# Altium project sombreakout.PrjPcb (part 1 of 2)
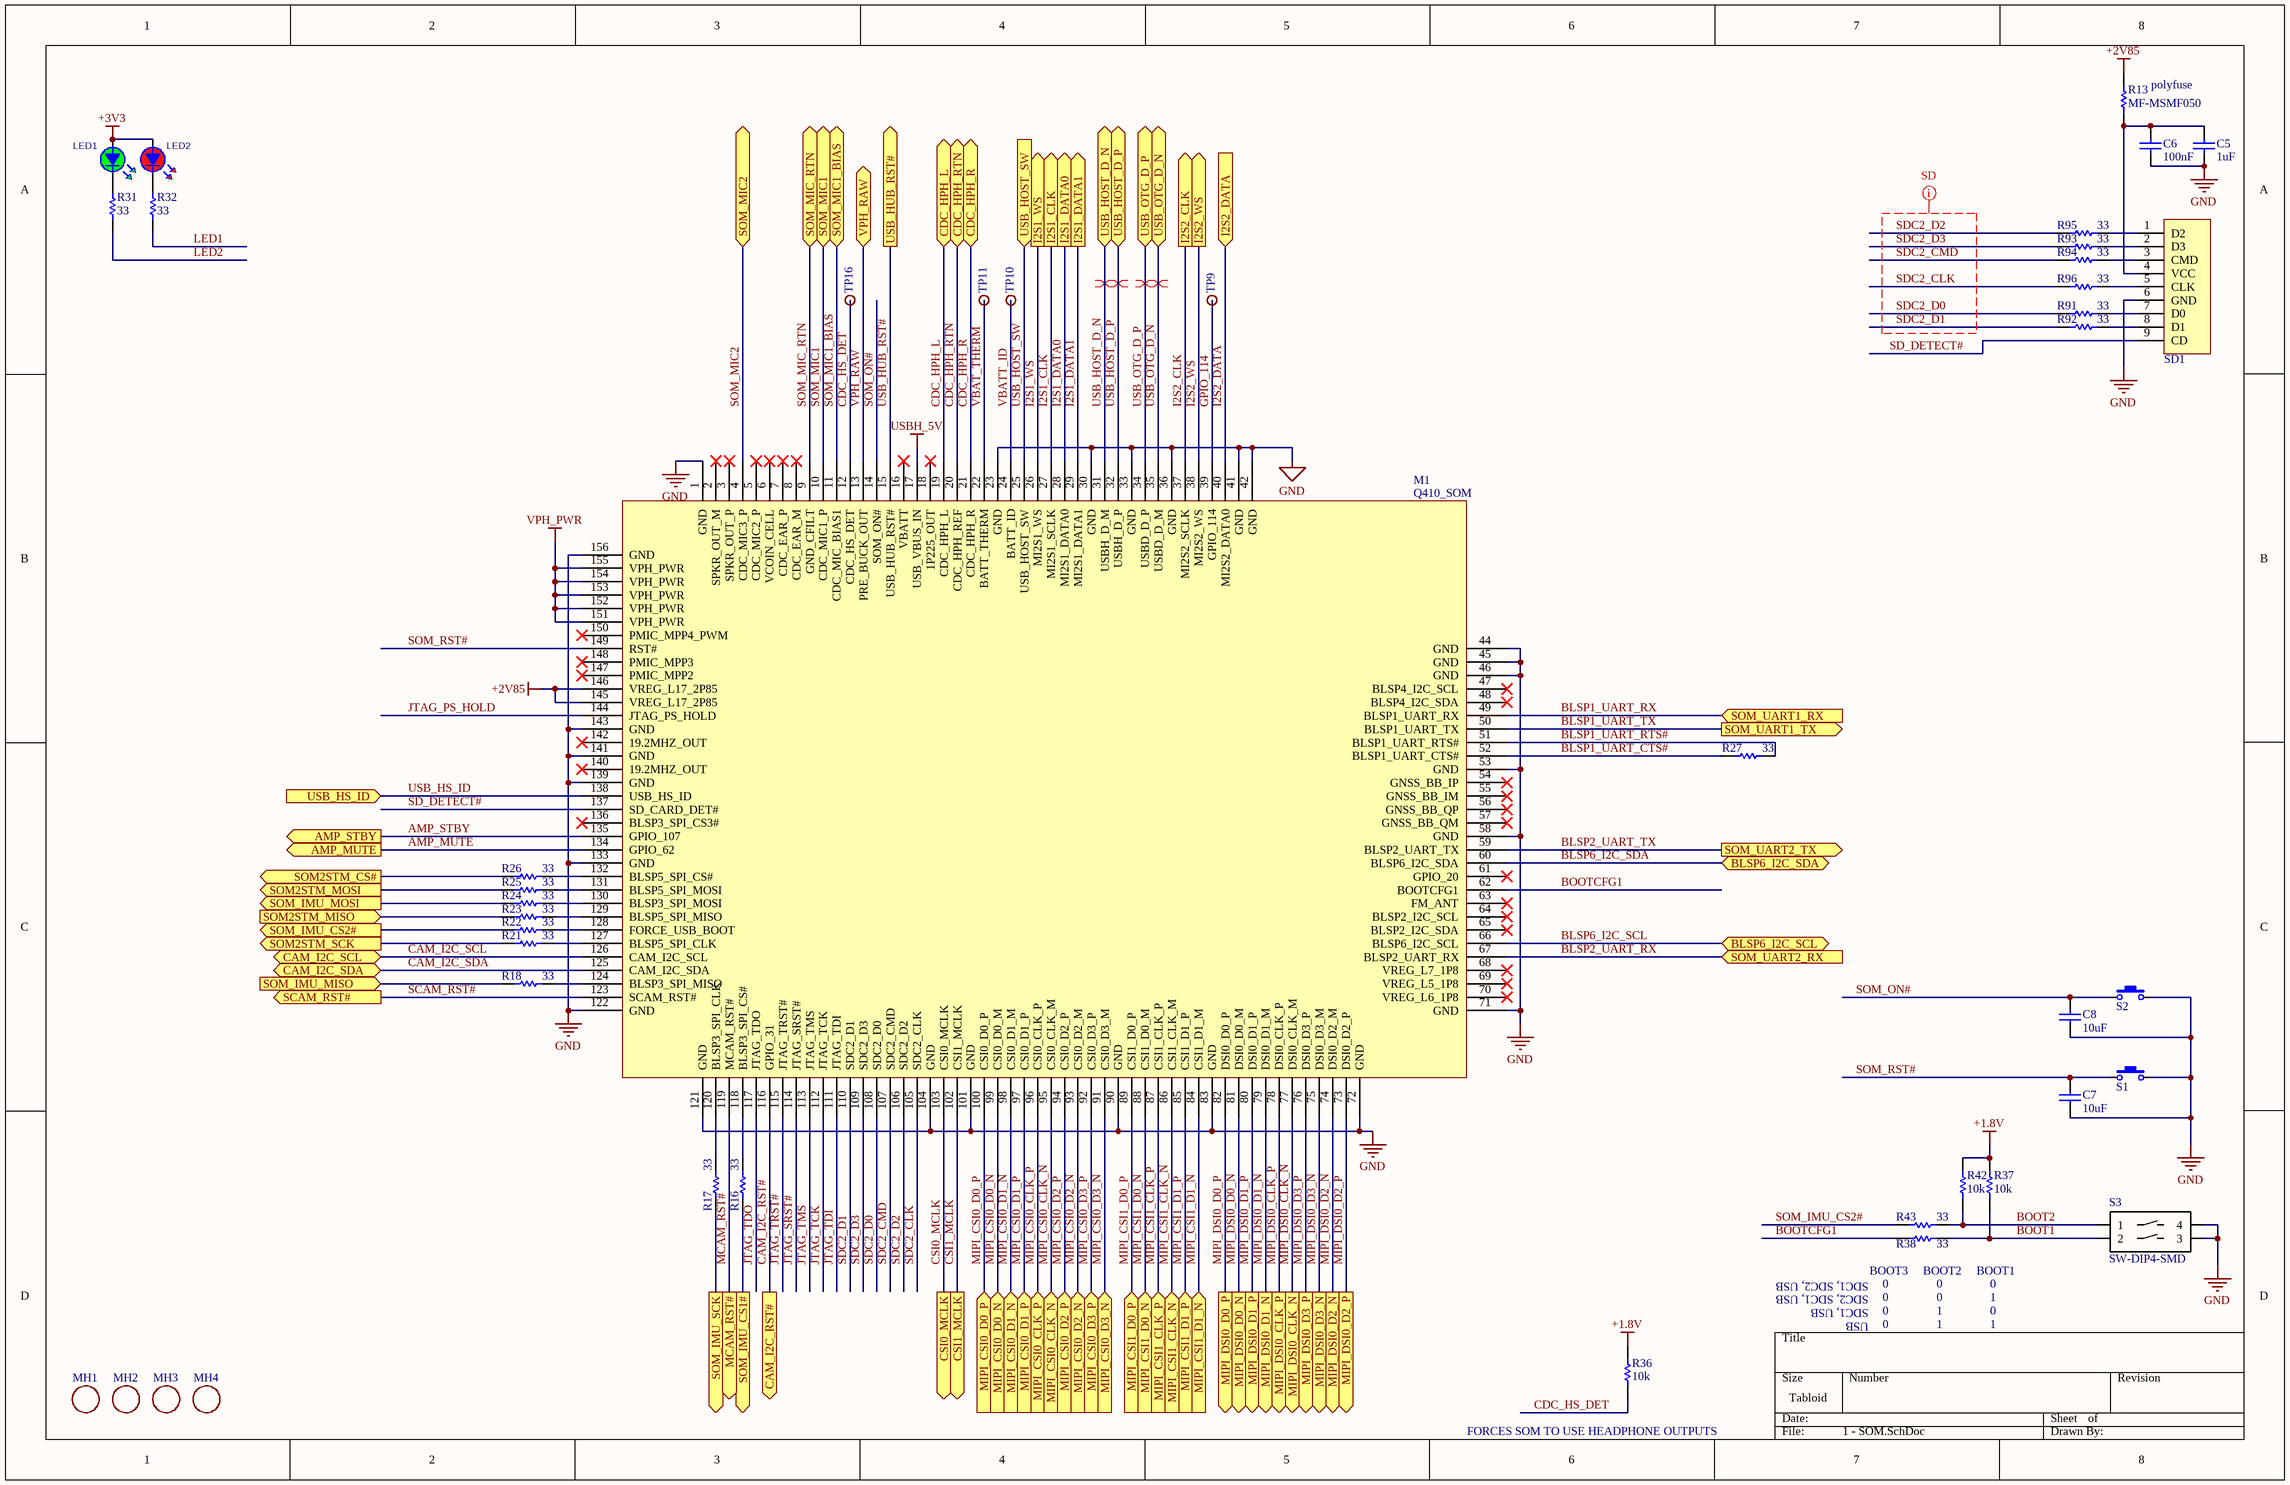
[diagram p0: 1 - SOM.SchDoc]
5 sheets, 291 parts. Net scope: flat (ports and power ports of the same name join across sheets).
Board file: sombreakout.PcbDoc
Sheets:
  1 - SOM.SchDoc
  2 - Peripherals.SchDoc
  3 - USB.SchDoc
  4 - Audio Amplifier.SchDoc
  6 - Power.SchDoc

## Sheet 1 - SOM.SchDoc
size Tabloid

### Parts
C5  value 1uF  [CAPC0805(2012)100_L]  (hidden comment: CAP 1uF 6.3V 0805(2012))
C6  value 100nF  [CAPC0805(2012)100_N]  (hidden comment: CAP 100nF 6.3V 0805(2012))
C7  value 10uF  [CAPC0805(2012)100_L]  (hidden comment: CAP 10uF 6.3V 0805(2012))
C8  value 10uF  [CAPC0805(2012)100_L]  (hidden comment: CAP 10uF 6.3V 0805(2012))
LED1  VLMG1500-GS08  [LEDC0402(1005)_N-GRN]  (value not drawn)
LED2  VLMS1500-GS08  [LEDC0402(1005)_N-RED]  (value not drawn)
M1  Q410_SOM  [Q410]
MH1  MOUNTING_HOLE125  [HOLE_MTG_125]  (value not drawn)
MH2  MOUNTING_HOLE125  [HOLE_MTG_125]  (value not drawn)
MH3  MOUNTING_HOLE125  [HOLE_MTG_125]  (value not drawn)
MH4  MOUNTING_HOLE125  [HOLE_MTG_125]  (value not drawn)
R13  MF-MSMF050  [BOUR-MF-MSMF050-2_V]
R16  value 33  [RESC0805(2012)_L]
R17  value 33  [RESC0805(2012)_L]
R18  value 33  [RESC0805(2012)_L]
R21  value 33  [RESC0805(2012)_L]
R22  value 33  [RESC0805(2012)_L]
R23  value 33  [RESC0805(2012)_L]
R24  value 33  [RESC0805(2012)_L]
R25  value 33  [RESC0805(2012)_L]
R26  value 33  [RESC0805(2012)_L]
R27  value 33  [RESC0805(2012)_L]
R31  value 33  [RESC0805(2012)_L]
R32  value 33  [RESC0805(2012)_L]
R36  value 10k  [RESC0805(2012)_L]  (hidden comment: 10K 1% 0805(2012))
R37  value 10k  [RESC0805(2012)_L]  (hidden comment: 10K 1% 0805(2012))
R38  value 33  [RESC0805(2012)_L]
R42  value 10k  [RESC0805(2012)_L]  (hidden comment: 10K 1% 0805(2012))
R43  value 33  [RESC0805(2012)_L]
R91  value 33  [RESC0805(2012)_L]
R92  value 33  [RESC0805(2012)_L]
R93  value 33  [RESC0805(2012)_L]
R94  value 33  [RESC0805(2012)_L]
R95  value 33  [RESC0805(2012)_L]
R96  value 33  [RESC0805(2012)_L]
S1  ButtonTACT_3x4x2_180  [ButtonTACT_3x4x2_180]  (value not drawn)
S2  ButtonTACT_3x4x2_180  [ButtonTACT_3x4x2_180]  (value not drawn)
S3  SW-DIP4-SMD  [SO4SW]
SD1  SD_Card_TF  [SD_Card_TF]  (value not drawn)
TP9  Various test points  [VIAHOLE20]  (value not drawn)
TP10  Various test points  [VIAHOLE20]  (value not drawn)
TP11  Various test points  [VIAHOLE20]  (value not drawn)
TP16  Various test points  [VIAHOLE20]  (value not drawn)

### Ports
AMP_MUTE (out), AMP_STBY (out), BLSP6_I2C_SCL (bidir), BLSP6_I2C_SDA (bidir), CAM_I2C_RST# (out), CAM_I2C_SCL (bidir), CAM_I2C_SDA (bidir), CDC_HPH_L, CDC_HPH_R, CDC_HPH_RTN, CSI0_MCLK (out), CSI1_MCLK (out), I2S1_CLK (out), I2S1_DATA0 (out), I2S1_DATA1 (out), I2S1_WS (out), I2S2_CLK (out), I2S2_DATA (in), I2S2_WS (out), MCAM_RST# (out), MIPI_CSI0_CLK_N (in), MIPI_CSI0_CLK_P (in), MIPI_CSI0_D0_N (in), MIPI_CSI0_D0_P (in), MIPI_CSI0_D1_N (in), MIPI_CSI0_D1_P (in), MIPI_CSI0_D2_N (in), MIPI_CSI0_D2_P (in), MIPI_CSI0_D3_N (in), MIPI_CSI0_D3_P (in), MIPI_CSI1_CLK_N (in), MIPI_CSI1_CLK_P (in), MIPI_CSI1_D0_N (in), MIPI_CSI1_D0_P (in), MIPI_CSI1_D1_N (in), MIPI_CSI1_D1_P (in), MIPI_DSI0_CLK_N (out), MIPI_DSI0_CLK_P (out), MIPI_DSI0_D0_N (out), MIPI_DSI0_D0_P (out), MIPI_DSI0_D1_N (out), MIPI_DSI0_D1_P (out), MIPI_DSI0_D2_N (out), MIPI_DSI0_D2_P (out), MIPI_DSI0_D3_N (out), MIPI_DSI0_D3_P (out), SCAM_RST# (out), SOM2STM_CS# (out), SOM2STM_MISO (in), SOM2STM_MOSI (out), SOM2STM_SCK (out), SOM_IMU_CS1# (out), SOM_IMU_CS2# (out), SOM_IMU_MISO (in), SOM_IMU_MOSI (out), SOM_IMU_SCK (out), SOM_MIC1, SOM_MIC1_BIAS, SOM_MIC2, SOM_MIC_RTN, SOM_UART1_RX (in), SOM_UART1_TX (out), SOM_UART2_RX (in), SOM_UART2_TX (out), USB_HOST_D_N, USB_HOST_D_P, USB_HOST_SW (in), USB_HS_ID (in), USB_HUB_RST# (out), USB_OTG_D_N, USB_OTG_D_P, VPH_RAW

### Nets
+1.8V: R36.1 R37.1 R42.1
+2V85: M1.145(VREG_L17_2P85) M1.146(VREG_L17_2P85) R13.2
+3V3: LED1.A LED2.A
GND: C5.2 C6.2 C7.1 C8.1 M1.1(GND) M1.23(GND) M1.30(GND) M1.33(GND) M1.36(GND) M1.41(GND) M1.42(GND) M1.44(GND) M1.45(GND) M1.46(GND) M1.53(GND) M1.58(GND) M1.71(GND) M1.72(GND) M1.83(GND) M1.90(GND) M1.101(GND) M1.104(GND) M1.121(GND) M1.122(GND) M1.133(GND) M1.139(GND) M1.141(GND) M1.143(GND) M1.156(GND) S1.2 S2.2 S3.3 S3.4 SD1.6(GND)
USBH_5V: M1.17(USB_VBUS_IN)
VPH_PWR: M1.151(VPH_PWR) M1.152(VPH_PWR) M1.153(VPH_PWR) M1.154(VPH_PWR) M1.155(VPH_PWR)
AMP_MUTE: M1.134(GPIO_62) ; port AMP_MUTE
AMP_STBY: M1.135(GPIO_107) ; port AMP_STBY
BLSP1_UART_CTS#: M1.52(BLSP1_UART_CTS#) R27.2
BLSP1_UART_RTS#: M1.51(BLSP1_UART_RTS#) R27.1
BLSP1_UART_RX: M1.49(BLSP1_UART_RX) ; port SOM_UART1_RX
BLSP1_UART_TX: M1.50(BLSP1_UART_TX) ; port SOM_UART1_TX
BLSP2_UART_RX: M1.67(BLSP2_UART_RX) ; port SOM_UART2_RX
BLSP2_UART_TX: M1.59(BLSP2_UART_TX) ; port SOM_UART2_TX
BLSP6_I2C_SCL: M1.66(BLSP6_I2C_SCL) ; port BLSP6_I2C_SCL
BLSP6_I2C_SDA: M1.60(BLSP6_I2C_SDA) ; port BLSP6_I2C_SDA
BOOT1: R37.2 R38.1 S3.2
BOOT2: R42.2 R43.1 S3.1
BOOTCFG1: M1.62(BOOTCFG1) R38.2
CAM_I2C_RST#: M1.116(GPIO_31) ; port CAM_I2C_RST#
CAM_I2C_SCL: M1.126(CAM_I2C_SCL) ; port CAM_I2C_SCL
CAM_I2C_SDA: M1.125(CAM_I2C_SDA) ; port CAM_I2C_SDA
CDC_HPH_L: M1.19(CDC_HPH_L) ; port CDC_HPH_L
CDC_HPH_R: M1.21(CDC_HPH_R) ; port CDC_HPH_R
CDC_HPH_RTN: M1.20(CDC_HPH_REF) ; port CDC_HPH_RTN
CDC_HS_DET: M1.12(CDC_HS_DET) R36.2 TP16.1
CSI0_MCLK: M1.103(CSI0_MCLK) ; port CSI0_MCLK
CSI1_MCLK: M1.102(CSI1_MCLK) ; port CSI1_MCLK
GPIO_114: M1.39(GPIO_114) TP9.1
I2S1_CLK: M1.27(MI2S1_SCLK) ; port I2S1_CLK
I2S1_DATA0: M1.28(MI2S1_DATA0) ; port I2S1_DATA0
I2S1_DATA1: M1.29(MI2S1_DATA1) ; port I2S1_DATA1
I2S1_WS: M1.26(MI2S1_WS) ; port I2S1_WS
I2S2_CLK: M1.37(MI2S2_SCLK) ; port I2S2_CLK
I2S2_DATA: M1.40(MI2S2_DATA0) ; port I2S2_DATA
I2S2_WS: M1.38(MI2S2_WS) ; port I2S2_WS
JTAG_PS_HOLD: M1.144(JTAG_PS_HOLD)
JTAG_SRST#: M1.114(JTAG_SRST#)
JTAG_TCK: M1.112(JTAG_TCK)
JTAG_TDI: M1.111(JTAG_TDI)
JTAG_TDO: M1.117(JTAG_TDO)
JTAG_TMS: M1.113(JTAG_TMS)
JTAG_TRST#: M1.115(JTAG_TRST#)
LED1: R32.2
LED2: R31.2
MCAM_RST#: M1.119(MCAM_RST#) ; port MCAM_RST#
MIPI_CSI0_CLK_N: M1.95(CSI0_CLK_M) ; port MIPI_CSI0_CLK_N
MIPI_CSI0_CLK_P: M1.96(CSI0_CLK_P) ; port MIPI_CSI0_CLK_P
MIPI_CSI0_D0_N: M1.99(CSI0_D0_M) ; port MIPI_CSI0_D0_N
MIPI_CSI0_D0_P: M1.100(CSI0_D0_P) ; port MIPI_CSI0_D0_P
MIPI_CSI0_D1_N: M1.98(CSI0_D1_M) ; port MIPI_CSI0_D1_N
MIPI_CSI0_D1_P: M1.97(CSI0_D1_P) ; port MIPI_CSI0_D1_P
MIPI_CSI0_D2_N: M1.93(CSI0_D2_M) ; port MIPI_CSI0_D2_N
MIPI_CSI0_D2_P: M1.94(CSI0_D2_P) ; port MIPI_CSI0_D2_P
MIPI_CSI0_D3_N: M1.91(CSI0_D3_M) ; port MIPI_CSI0_D3_N
MIPI_CSI0_D3_P: M1.92(CSI0_D3_P) ; port MIPI_CSI0_D3_P
MIPI_CSI1_CLK_N: M1.86(CSI1_CLK_M) ; port MIPI_CSI1_CLK_N
MIPI_CSI1_CLK_P: M1.87(CSI1_CLK_P) ; port MIPI_CSI1_CLK_P
MIPI_CSI1_D0_N: M1.88(CSI1_D0_M) ; port MIPI_CSI1_D0_N
MIPI_CSI1_D0_P: M1.89(CSI1_D0_P) ; port MIPI_CSI1_D0_P
MIPI_CSI1_D1_N: M1.84(CSI1_D1_M) ; port MIPI_CSI1_D1_N
MIPI_CSI1_D1_P: M1.85(CSI1_D1_P) ; port MIPI_CSI1_D1_P
MIPI_DSI0_CLK_N: M1.77(DSI0_CLK_M) ; port MIPI_DSI0_CLK_N
MIPI_DSI0_CLK_P: M1.78(DSI0_CLK_P) ; port MIPI_DSI0_CLK_P
MIPI_DSI0_D0_N: M1.81(DSI0_D0_M) ; port MIPI_DSI0_D0_N
MIPI_DSI0_D0_P: M1.82(DSI0_D0_P) ; port MIPI_DSI0_D0_P
MIPI_DSI0_D1_N: M1.79(DSI0_D1_M) ; port MIPI_DSI0_D1_N
MIPI_DSI0_D1_P: M1.80(DSI0_D1_P) ; port MIPI_DSI0_D1_P
MIPI_DSI0_D2_N: M1.74(DSI0_D2_M) ; port MIPI_DSI0_D2_N
MIPI_DSI0_D2_P: M1.73(DSI0_D2_P) ; port MIPI_DSI0_D2_P
MIPI_DSI0_D3_N: M1.75(DSI0_D3_M) ; port MIPI_DSI0_D3_N
MIPI_DSI0_D3_P: M1.76(DSI0_D3_P) ; port MIPI_DSI0_D3_P
SCAM_RST#: M1.123(SCAM_RST#) ; port SCAM_RST#
SD_DETECT#: M1.137(SD_CARD_DET#) SD1.9(CD)
SDC2_CLK: M1.105(SDC2_CLK) R96.2
SDC2_CMD: M1.107(SDC2_CMD) R94.2
SDC2_D0: M1.108(SDC2_D0) R91.2
SDC2_D1: M1.110(SDC2_D1) R92.2
SDC2_D2: M1.106(SDC2_D2) R95.2
SDC2_D3: M1.109(SDC2_D3) R93.2
SOM_IMU_CS2#: R43.2
SOM_MIC1: M1.10(CDC_MIC1_P) ; port SOM_MIC1
SOM_MIC1_BIAS: M1.11(CDC_MIC_BIAS1) ; port SOM_MIC1_BIAS
SOM_MIC2: M1.4(CDC_MIC3_P) ; port SOM_MIC2
SOM_MIC_RTN: M1.9(GND_CFILT) ; port SOM_MIC_RTN
SOM_ON#: C8.2 M1.14(SOM_ON#) S2.1
SOM_RST#: C7.2 M1.149(RST#) S1.1
USB_HOST_D_N: M1.31(USBH_D_M) ; port USB_HOST_D_N
USB_HOST_D_P: M1.32(USBH_D_P) ; port USB_HOST_D_P
USB_HOST_SW: M1.25(USB_HOST_SW) ; port USB_HOST_SW
USB_HS_ID: M1.138(USB_HS_ID) ; port USB_HS_ID
USB_HUB_RST#: M1.15(USB_HUB_RST#) ; port USB_HUB_RST#
USB_OTG_D_N: M1.35(USBD_D_M) ; port USB_OTG_D_N
USB_OTG_D_P: M1.34(USBD_D_P) ; port USB_OTG_D_P
VBAT_THERM: M1.22(BATT_THERM) TP11.1
VBATT_ID: M1.24(BATT_ID) TP10.1
VPH_RAW: M1.13(PRE_BUCK_OUT) ; port VPH_RAW
NetC5_1: C5.1 C6.1 R13.1 SD1.4(VCC)
NetJ12_9: R23.2 ; port SOM2STM_MISO
NetJ12_13: R25.2 ; port SOM2STM_MOSI
NetJ12_17: R21.2 ; port SOM2STM_SCK
NetJ12_21: R26.2 ; port SOM2STM_CS#
NetLED1_K: LED1.K R31.1
NetLED2_K: LED2.K R32.1
NetM1_118: M1.118(BLSP3_SPI_CS#) R16.1
NetM1_120: M1.120(BLSP3_SPI_CLK) R17.1
NetM1_124: M1.124(BLSP3_SPI_MISO) R18.1
NetM1_127: M1.127(BLSP5_SPI_CLK) R21.1
NetM1_128: M1.128(FORCE_USB_BOOT) R22.1
NetM1_129: M1.129(BLSP5_SPI_MISO) R23.1
NetM1_130: M1.130(BLSP3_SPI_MOSI) R24.1
NetM1_131: M1.131(BLSP5_SPI_MOSI) R25.1
NetM1_132: M1.132(BLSP5_SPI_CS#) R26.1
NetR16_2: R16.2 ; port SOM_IMU_CS1#
NetR17_2: R17.2 ; port SOM_IMU_SCK
NetR18_2: R18.2 ; port SOM_IMU_MISO
NetR22_2: R22.2 ; port SOM_IMU_CS2#
NetR24_2: R24.2 ; port SOM_IMU_MOSI
NetR91_1: R91.1 SD1.7(D0)
NetR92_1: R92.1 SD1.8(D1)
NetR93_1: R93.1 SD1.2(D3)
NetR94_1: R94.1 SD1.3(CMD)
NetR95_1: R95.1 SD1.1(D2)
NetR96_1: R96.1 SD1.5(CLK)

Not connected (* = marked no-connect by the designer): M1 2(SPKR_OUT_M)* 3(SPKR_OUT_P)* 5(CDC_MIC2_P)* 6(VCOIN_CELL)* 7(CDC_EAR_P)* 8(CDC_EAR_M)* 16(VBATT)* 18(1P225_OUT)* 47(BLSP4_I2C_SCL)* 48(BLSP4_I2C_SDA)* 54(GNSS_BB_IP)* 55(GNSS_BB_IM)* 56(GNSS_BB_QP)* 57(GNSS_BB_QM)* 61(GPIO_20)* 63(FM_ANT)* 64(BLSP2_I2C_SCL)* 65(BLSP2_I2C_SDA)* 68(VREG_L7_1P8)* 69(VREG_L5_1P8)* 70(VREG_L6_1P8)* 136(BLSP3_SPI_CS3#)* 140(19.2MHZ_OUT)* 142(19.2MHZ_OUT)* 147(PMIC_MPP2)* 148(PMIC_MPP3)* 150(PMIC_MPP4_PWM)*

### Layout directives
differential pair: USB_HOST_D_N, USB_HOST_D_P, USB_OTG_D_N, USB_OTG_D_P
net class SD: SDC2_CLK, SDC2_CMD, SDC2_D0, SDC2_D1, SDC2_D2, SDC2_D3

### Notes on the sheet
- (near R13) polyfuse
- SDC1, SDC2, USB
- SDC2, SDC1, USB
- SDC1, USB
- BOOT3
- 0
- BOOT2
- BOOT1
- 1
- USB
- (near R36) FORCES SOM TO USE HEADPHONE OUTPUTS

### Library data of the parts
C5 = CMP-1036-04730-1: CAP 1uF 6.3V Â±5% 0805 (2012 Metric) Thickness 1mm SMD; Case-Metric: 2012; Case-EIA: 0805; Technology: SMT; Tolerance: Â±5%; Max Thickness: 1 mm; Rated Voltage: 6.3 V
C6 = CMP-1036-04391-1: CAP 100nF 6.3V Â±10% 0805 (2012 Metric) Thickness 1mm SMD; Case-EIA: 0805; Case-Metric: 2012; Rated Voltage: 6.3 V; Technology: SMT; Tolerance: Â±10%; Max Thickness: 1 mm
C7 C8 = CMP-1036-04917-1: CAP 10uF 6.3V Â±10% 0805 (2012 Metric) Thickness 1mm SMD; Case-EIA: 0805; Case-Metric: 2012; Max Thickness: 1 mm; Tolerance: Â±10%; Technology: SMT; Rated Voltage: 6.3 V
LED1 = LED_0402_VLMG1500-GS08: LED GREEN 0402 SMD; Manufacturer: Vishay Semiconductor Opto Division; Wavelength - Dominant: 571nm; Wavelength - Peak: 574nm; Millicandela Rating: 35mcd; Voltage - Forward (Vf) (Typ): 2V; Current - Test: 20mA; Viewing Angle: 130°; Lens Style/Size: Rectangle with Flat Top, 1.00mm x 0.50mm; Supplier 1: Digi-Key; Manufacturer Part Number: VLMG1500-GS08; RoHS: RoHS Compliant; Category: Optoelectronics; Stock 1: 37065; Pricing 1: 1=0.52, 10=0.384, 25=0.3072, 100=0.2035, 250=0.144, 500=0.12288, 750=0.10368, 1000=0.096 (USD); Packaging: Cut Tape (CT); Color: Green; Lens Transparency: -; Lens Color: -; Package / Case: 0402 (1005 Metric); Supplier Device Package: 0402; Size / Dimension: 1.00mm L x 0.50mm W; Height (Max): 0.35mm; Mounting Type: Surface Mount; ComponentLink1URL: http://www.vishay.com/docs/82554/vlmo1500.pdf; ComponentLink1Description: http://www.vishay.com/docs/82554/vlmo1500.pdf; Supplier Part Number 1: VLMG1500-GS08CT-ND
LED2 = LED_0402_VLMS1500-GS08: LED RED 0402 SMD; Manufacturer: Vishay Semiconductor Opto Division; Wavelength - Dominant: 631nm; Wavelength - Peak: 639nm; Millicandela Rating: 54mcd; Voltage - Forward (Vf) (Typ): 2V; Current - Test: 20mA; Viewing Angle: 130°; Lens Style/Size: Rectangle with Flat Top, 1.00mm x 0.50mm; Supplier 1: Digi-Key; Manufacturer Part Number: VLMS1500-GS08; RoHS: RoHS Compliant; Category: Optoelectronics; Stock 1: 41406; Pricing 1: 1=0.52, 10=0.384, 25=0.3072, 100=0.2035, 250=0.144, 500=0.12288, 750=0.10368, 1000=0.096 (USD); Packaging: Cut Tape (CT); Color: Red; Lens Transparency: -; Lens Color: -; Package / Case: 0402 (1005 Metric); Supplier Device Package: 0402; Size / Dimension: 1.00mm L x 0.50mm W; Height (Max): 0.35mm; Mounting Type: Surface Mount; ComponentLink1URL: http://www.vishay.com/docs/82554/vlmo1500.pdf; ComponentLink1Description: http://www.vishay.com/docs/82554/vlmo1500.pdf; Supplier Part Number 1: VLMS1500-GS08CT-ND
M1 = Q410
R13 = CMP-0280-00002-2: MF-MSMF Series - PTC Resettable Fuse, 15 V Max, 0.15 Ohm Min, -40 to 85 degC, RoHS, Reel; Manufacturer: Bourns; Voltage DC (Max): 15 V; Trip Current: 1 A; Hold Current: 0.5 A; Current Rating (Max): 100 A; ComponentLink1Description: Manufacturer URL; Operating Temperature Range: -40 to 85 degC; ComponentLink2URL: http://www.bourns.com/data/global/pdfs/mfmsmf.pdf; PackageReference: MF-MSMF050; ComponentLink2Description: Datasheet; PartNumber: MF-MSMF050; DatasheetVersion: Rev. AD; ComponentLink3URL: http://www.bourns.com/data/global/pdfs/mfmsmf.pdf; ComponentLink3Description: Package Specification; RoHS: TRUE; PackageDescription: 2-Pin SMD, Body 4.55 x 3.24 mm; Mounting Technology: Surface Mount; Packing: Reel; Resistance (Min): 0.15 Ohm; ComponentLink1URL: http://www.bourns.com/
R16-R18 R21-R27 R31 R32 R36-R38 R42 R43 R91-R96 = CMP-1013-00623-1: 10K 0.125W 1% 0805 (2012 Metric)  SMD; Case-Metric: 2012; Case-EIA: 0805; Tolerance: 1 %; Power: 0.125 W; Technology: SMT
S1 S2 = ButtonTACT_3x4x2_180: Button
S3 = SW-DIP4-SMD: 2 POLE DIP SWITCH SMD
SD1 = SD_Card_TF: SD
TP9-TP11 TP16 = TESTPOINTHOLE035

## Sheet 2 - Peripherals.SchDoc
size Tabloid
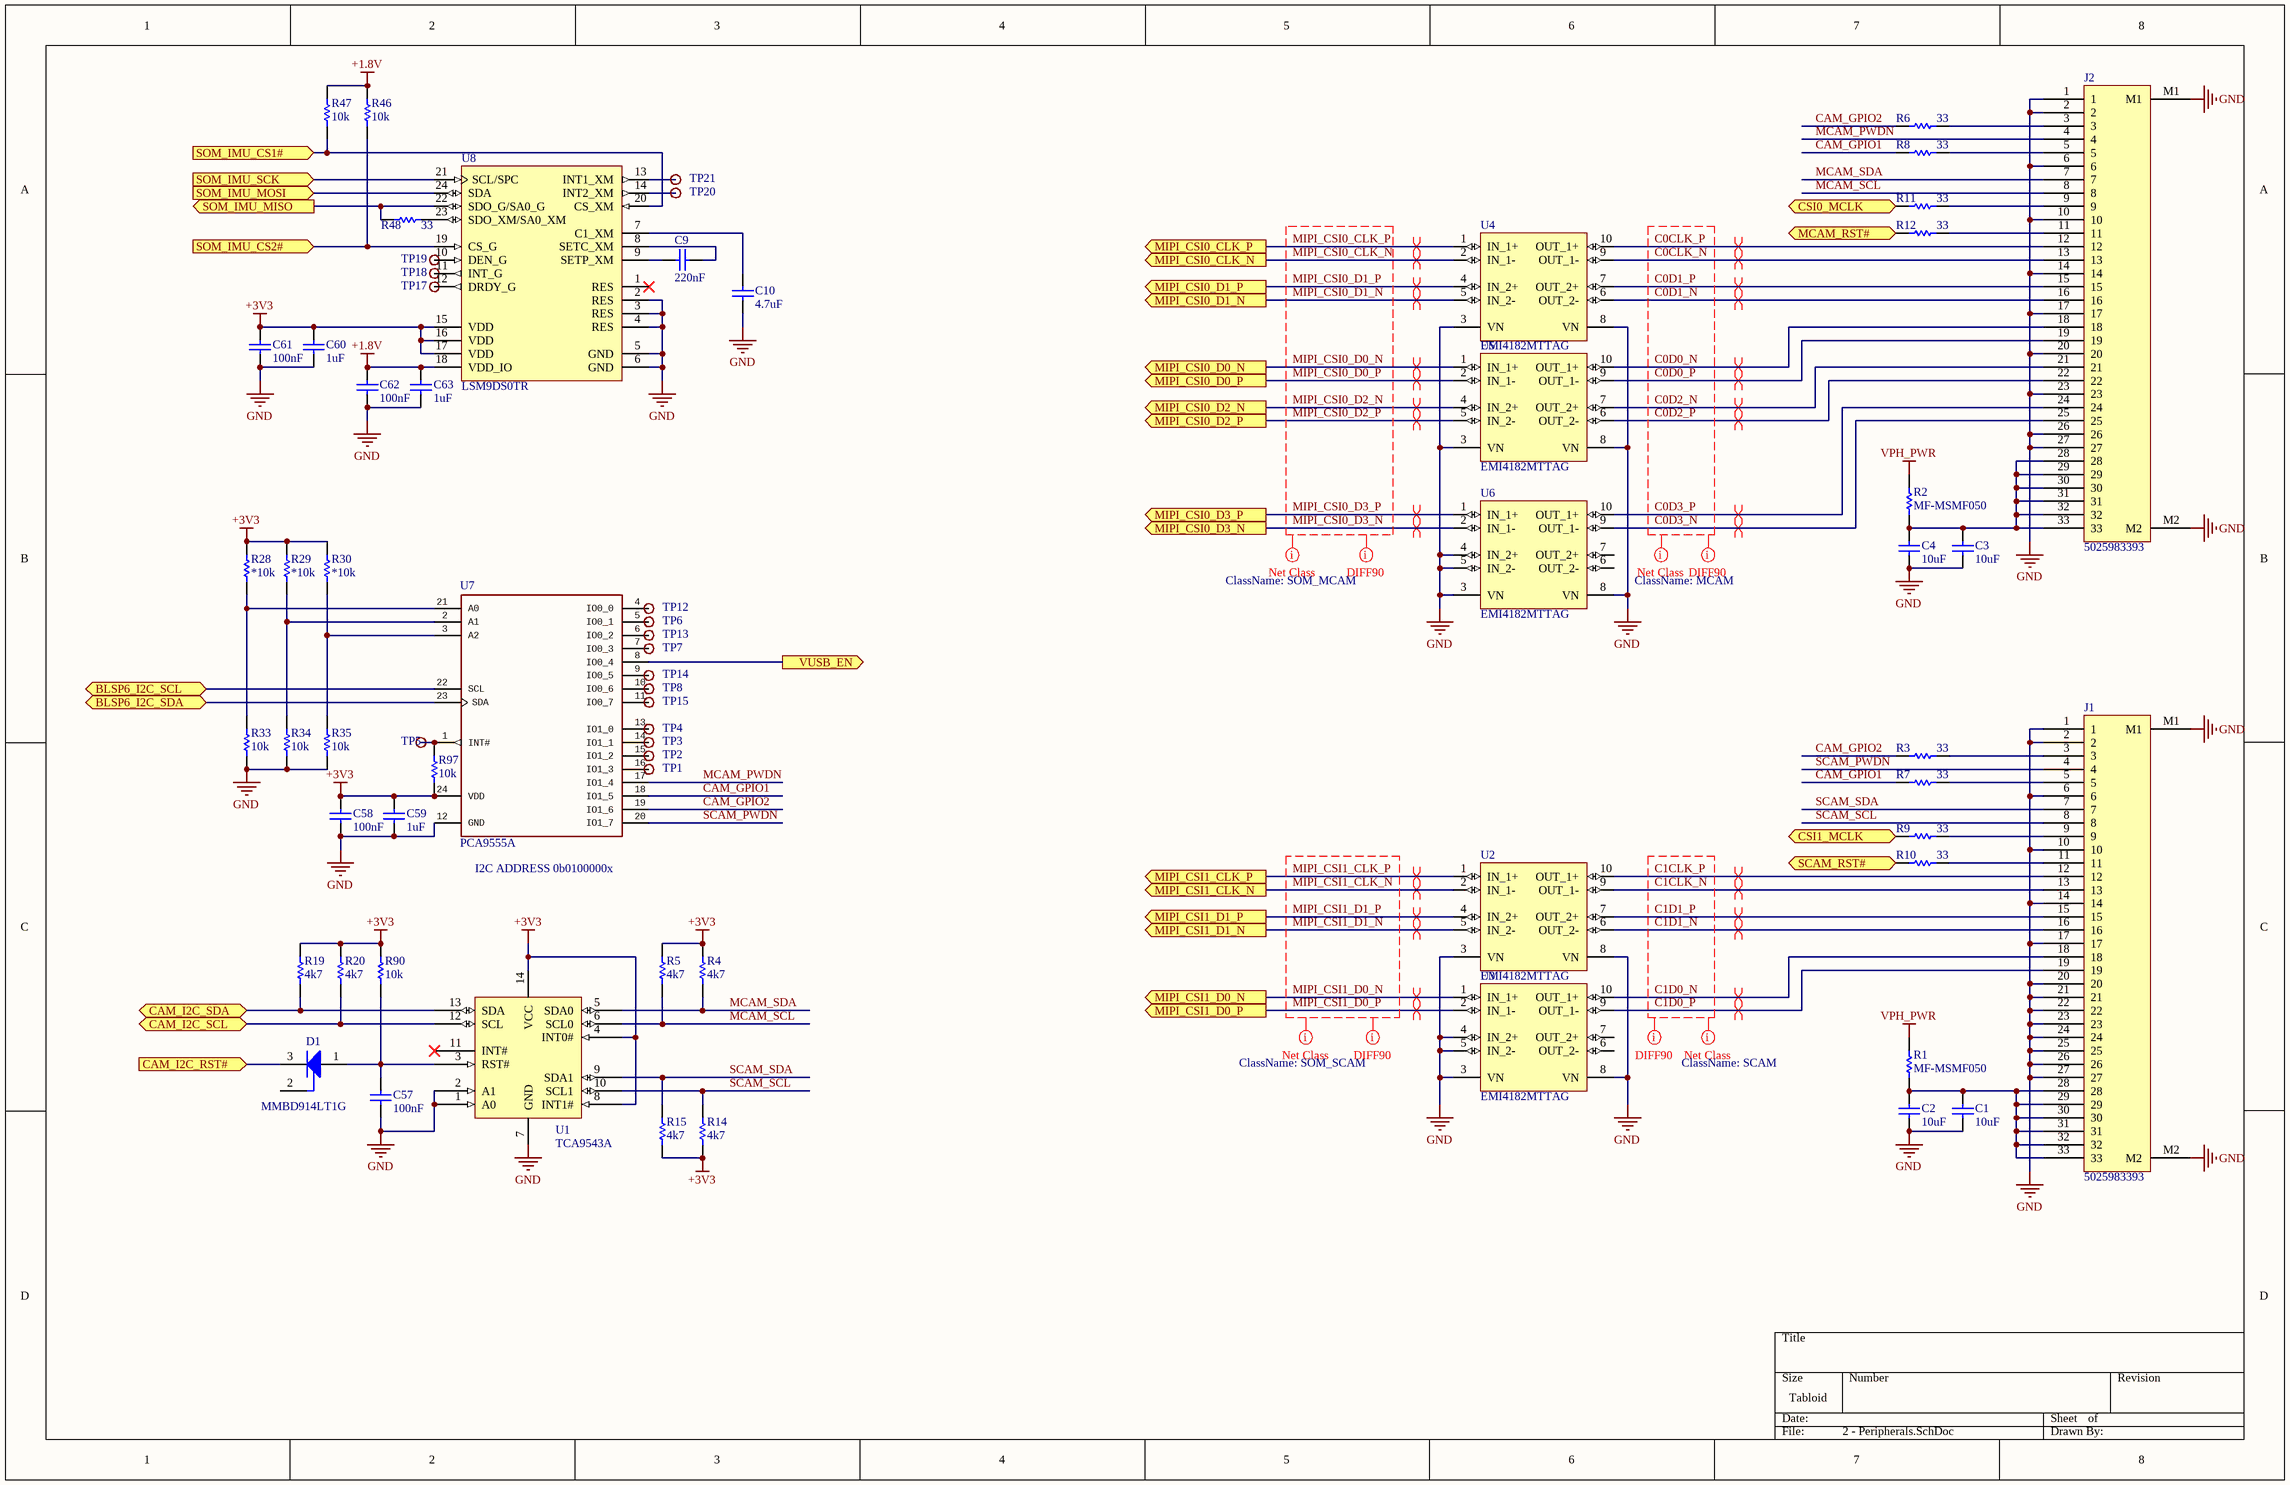
[diagram p1: 2 - Peripherals.SchDoc]

### Parts
C1  value 10uF  [CAPC0805(2012)100_L]  (hidden comment: CAP 10uF 6.3V 0805(2012))
C2  value 10uF  [CAPC0805(2012)100_L]  (hidden comment: CAP 10uF 6.3V 0805(2012))
C3  value 10uF  [CAPC0805(2012)100_L]  (hidden comment: CAP 10uF 6.3V 0805(2012))
C4  value 10uF  [CAPC0805(2012)100_L]  (hidden comment: CAP 10uF 6.3V 0805(2012))
C9  value 220nF  [CAPC0805(2012)100_L]
C10  value 4.7uF  [CAPC0805(2012)100_L]  (hidden comment: CAP 4.7uF 6.3V 0805(2012))
C57  value 100nF  [CAPC0805(2012)100_L]  (hidden comment: CAP 100nF 6.3V 0805(2012))
C58  value 100nF  [CAPC0805(2012)100_L]  (hidden comment: CAP 100nF 6.3V 0805(2012))
C59  value 1uF  [CAPC0805(2012)100_L]  (hidden comment: CAP 1uF 6.3V 0805(2012))
C60  value 1uF  [CAPC0805(2012)100_L]  (hidden comment: CAP 1uF 6.3V 0805(2012))
C61  value 100nF  [CAPC0805(2012)100_L]  (hidden comment: CAP 100nF 6.3V 0805(2012))
C62  value 100nF  [CAPC0805(2012)100_L]  (hidden comment: CAP 100nF 6.3V 0805(2012))
C63  value 1uF  [CAPC0805(2012)100_L]  (hidden comment: CAP 1uF 6.3V 0805(2012))
D1  MMBD914LT1G  [ONSC-SOT-23-3-318-08_V]
J1  5025983393  [J_MOLEX_50259833]
J2  5025983393  [J_MOLEX_50259833]
R1  MF-MSMF050  [BOUR-MF-MSMF050-2_V]
R2  MF-MSMF050  [BOUR-MF-MSMF050-2_V]
R3  value 33  [RESC0805(2012)_L]  (hidden comment: 33R 1% 0805(2012))
R4  value 4k7  [RESC0805(2012)_L]  (hidden comment: 4K7 1% 0805(2012))
R5  value 4k7  [RESC0805(2012)_L]  (hidden comment: 4K7 1% 0805(2012))
R6  value 33  [RESC0805(2012)_L]  (hidden comment: 33R 1% 0805(2012))
R7  value 33  [RESC0805(2012)_L]  (hidden comment: 33R 1% 0805(2012))
R8  value 33  [RESC0805(2012)_L]  (hidden comment: 33R 1% 0805(2012))
R9  value 33  [RESC0805(2012)_L]  (hidden comment: 33R 1% 0805(2012))
R10  value 33  [RESC0805(2012)_L]  (hidden comment: 33R 1% 0805(2012))
R11  value 33  [RESC0805(2012)_L]  (hidden comment: 33R 1% 0805(2012))
R12  value 33  [RESC0805(2012)_L]  (hidden comment: 33R 1% 0805(2012))
R14  value 4k7  [RESC0805(2012)_L]  (hidden comment: 4K7 1% 0805(2012))
R15  value 4k7  [RESC0805(2012)_L]  (hidden comment: 4K7 1% 0805(2012))
R19  value 4k7  [RESC0805(2012)_L]  (hidden comment: 4K7 1% 0805(2012))
R20  value 4k7  [RESC0805(2012)_L]  (hidden comment: 4K7 1% 0805(2012))
R28  value *10k  [RESC0805(2012)_L]  (hidden comment: 100k)
R29  value *10k  [RESC0805(2012)_L]  (hidden comment: 100k)
R30  value *10k  [RESC0805(2012)_L]  (hidden comment: 100k)
R33  value 10k  [RESC0805(2012)_L]  (hidden comment: 100k)
R34  value 10k  [RESC0805(2012)_L]  (hidden comment: 100k)
R35  value 10k  [RESC0805(2012)_L]  (hidden comment: 100k)
R46  value 10k  [RESC0805(2012)_L]  (hidden comment: 10K 1% 0805(2012))
R47  value 10k  [RESC0805(2012)_L]  (hidden comment: 10K 1% 0805(2012))
R48  value 33  [RESC0805(2012)_L]  (hidden comment: 33R 1% 0805(2012))
R90  value 10k  [RESC0805(2012)_L]  (hidden comment: 100k)
R97  10k  [RESC0805(2012)_L]
TP1  Various test points  [VIAHOLE20]  (value not drawn)
TP2  Various test points  [VIAHOLE20]  (value not drawn)
TP3  Various test points  [VIAHOLE20]  (value not drawn)
TP4  Various test points  [VIAHOLE20]  (value not drawn)
TP5  Various test points  [VIAHOLE20]  (value not drawn)
TP6  Various test points  [VIAHOLE20]  (value not drawn)
TP7  Various test points  [VIAHOLE20]  (value not drawn)
TP8  Various test points  [VIAHOLE20]  (value not drawn)
TP12  Various test points  [VIAHOLE20]  (value not drawn)
TP13  Various test points  [VIAHOLE20]  (value not drawn)
TP14  Various test points  [VIAHOLE20]  (value not drawn)
TP15  Various test points  [VIAHOLE20]  (value not drawn)
TP17  Various test points  [VIAHOLE20]  (value not drawn)
TP18  Various test points  [VIAHOLE20]  (value not drawn)
TP19  Various test points  [VIAHOLE20]  (value not drawn)
TP20  Various test points  [VIAHOLE20]  (value not drawn)
TP21  Various test points  [VIAHOLE20]  (value not drawn)
U1  TCA9543A  [SO14]
U2  EMI4182MTTAG  [ONSC-WDFN-10-511BM-01_V]
U3  EMI4182MTTAG  [ONSC-WDFN-10-511BM-01_V]
U4  EMI4182MTTAG  [ONSC-WDFN-10-511BM-01_V]
U5  EMI4182MTTAG  [ONSC-WDFN-10-511BM-01_V]
U6  EMI4182MTTAG  [ONSC-WDFN-10-511BM-01_V]
U7  PCA9555A  [SSOP24]
U8  LSM9DS0TR  [STM-LGA-24_V]

### Ports
BLSP6_I2C_SCL (bidir), BLSP6_I2C_SDA (bidir), CAM_I2C_RST# (in), CAM_I2C_SCL (bidir), CAM_I2C_SDA (bidir), CSI0_MCLK (in), CSI1_MCLK (in), MCAM_RST# (in), MIPI_CSI0_CLK_N (out), MIPI_CSI0_CLK_P (out), MIPI_CSI0_D0_N (out), MIPI_CSI0_D0_P (out), MIPI_CSI0_D1_N (out), MIPI_CSI0_D1_P (out), MIPI_CSI0_D2_N (out), MIPI_CSI0_D2_P (out), MIPI_CSI0_D3_N (out), MIPI_CSI0_D3_P (out), MIPI_CSI1_CLK_N (out), MIPI_CSI1_CLK_P (out), MIPI_CSI1_D0_N (out), MIPI_CSI1_D0_P (out), MIPI_CSI1_D1_N (out), MIPI_CSI1_D1_P (out), SCAM_RST# (in), SOM_IMU_CS1# (in), SOM_IMU_CS2# (in), SOM_IMU_MISO (out), SOM_IMU_MOSI (in), SOM_IMU_SCK (in), VUSB_EN (out)

### Nets
+1.8V: C62.1 C63.1 R46.1 R47.1 U8.18(VDD_IO)
+3V3: C58.1 C59.1 C60.1 C61.1 R4.2 R5.2 R14.1 R15.1 R19.2 R20.2 R28.2 R29.2 R30.2 R90.2 R97.1 U1.4(INT0#) U1.8(INT1#) U1.14(VCC) U7.24(VDD) U8.15(VDD) U8.16(VDD) U8.17(VDD)
GND: C1.1 C2.1 C3.1 C4.1 C10.1 C57.2 C58.2 C59.2 C60.2 C61.2 C62.2 C63.2 J1.1 J1.2 J1.6 J1.10 J1.14 J1.17 J1.20 J1.21 J1.22 J1.23 J1.24 J1.25 J1.26 J1.27 J1.M1 J1.M2 J2.1 J2.2 J2.6 J2.10 J2.14 J2.17 J2.20 J2.23 J2.26 J2.27 J2.M1 J2.M2 R33.1 R34.1 R35.1 U1.1(A0) U1.2(A1) U1.7(GND) U2.3(VN) U2.8(VN) U3.3(VN) U3.4(IN_2+) U3.5(IN_2-) U3.8(VN) U4.3(VN) U4.8(VN) U5.3(VN) U5.8(VN) U6.3(VN) U6.4(IN_2+) U6.5(IN_2-) U6.8(VN) U7.12(GND) U8.2(RES) U8.3(RES) U8.4(RES) U8.5(GND) U8.6(GND)
VPH_PWR: R1.2 R2.2
BLSP6_I2C_SCL: U7.22(SCL) ; port BLSP6_I2C_SCL
BLSP6_I2C_SDA: U7.23(SDA) ; port BLSP6_I2C_SDA
C0CLK_N: J2.13 U4.9(OUT_1-)
C0CLK_P: J2.12 U4.10(OUT_1+)
C0D0_N: J2.18 U5.10(OUT_1+)
C0D0_P: J2.19 U5.9(OUT_1-)
C0D1_N: J2.16 U4.6(OUT_2-)
C0D1_P: J2.15 U4.7(OUT_2+)
C0D2_N: J2.21 U5.7(OUT_2+)
C0D2_P: J2.22 U5.6(OUT_2-)
C0D3_N: J2.25 U6.9(OUT_1-)
C0D3_P: J2.24 U6.10(OUT_1+)
C1CLK_N: J1.13 U2.9(OUT_1-)
C1CLK_P: J1.12 U2.10(OUT_1+)
C1D0_N: J1.18 U3.10(OUT_1+)
C1D0_P: J1.19 U3.9(OUT_1-)
C1D1_N: J1.16 U2.6(OUT_2-)
C1D1_P: J1.15 U2.7(OUT_2+)
CAM_GPIO1: R7.1 R8.1 U7.18(IO1_5)
CAM_GPIO2: R3.1 R6.1 U7.19(IO1_6)
CAM_I2C_RST#: D1.3(K) ; port CAM_I2C_RST#
CAM_I2C_SCL: R20.1 U1.12(SCL) ; port CAM_I2C_SCL
CAM_I2C_SDA: R19.1 U1.13(SDA) ; port CAM_I2C_SDA
CSI0_MCLK: R11.1 ; port CSI0_MCLK
CSI1_MCLK: R9.1 ; port CSI1_MCLK
MCAM_PWDN: J2.4 U7.17(IO1_4)
MCAM_RST#: R12.1 ; port MCAM_RST#
MCAM_SCL: J2.8 R5.1 U1.6(SCL0)
MCAM_SDA: J2.7 R4.1 U1.5(SDA0)
MIPI_CSI0_CLK_N: U4.2(IN_1-) ; port MIPI_CSI0_CLK_N
MIPI_CSI0_CLK_P: U4.1(IN_1+) ; port MIPI_CSI0_CLK_P
MIPI_CSI0_D0_N: U5.1(IN_1+) ; port MIPI_CSI0_D0_N
MIPI_CSI0_D0_P: U5.2(IN_1-) ; port MIPI_CSI0_D0_P
MIPI_CSI0_D1_N: U4.5(IN_2-) ; port MIPI_CSI0_D1_N
MIPI_CSI0_D1_P: U4.4(IN_2+) ; port MIPI_CSI0_D1_P
MIPI_CSI0_D2_N: U5.4(IN_2+) ; port MIPI_CSI0_D2_N
MIPI_CSI0_D2_P: U5.5(IN_2-) ; port MIPI_CSI0_D2_P
MIPI_CSI0_D3_N: U6.2(IN_1-) ; port MIPI_CSI0_D3_N
MIPI_CSI0_D3_P: U6.1(IN_1+) ; port MIPI_CSI0_D3_P
MIPI_CSI1_CLK_N: U2.2(IN_1-) ; port MIPI_CSI1_CLK_N
MIPI_CSI1_CLK_P: U2.1(IN_1+) ; port MIPI_CSI1_CLK_P
MIPI_CSI1_D0_N: U3.1(IN_1+) ; port MIPI_CSI1_D0_N
MIPI_CSI1_D0_P: U3.2(IN_1-) ; port MIPI_CSI1_D0_P
MIPI_CSI1_D1_N: U2.5(IN_2-) ; port MIPI_CSI1_D1_N
MIPI_CSI1_D1_P: U2.4(IN_2+) ; port MIPI_CSI1_D1_P
SCAM_PWDN: J1.4 U7.20(IO1_7)
SCAM_RST#: R10.1 ; port SCAM_RST#
SCAM_SCL: J1.8 R14.2 U1.10(SCL1)
SCAM_SDA: J1.7 R15.2 U1.9(SDA1)
NetC1_2: C1.2 C2.2 J1.28 J1.29 J1.30 J1.31 J1.32 J1.33 R1.1
NetC3_2: C3.2 C4.2 J2.28 J2.29 J2.30 J2.31 J2.32 J2.33 R2.1
NetC9_1: C9.1 U8.9(SETP_XM)
NetC9_2: C9.2 U8.8(SETC_XM)
NetC10_2: C10.2 U8.7(C1_XM)
NetC57_1: C57.1 D1.1(A) R90.1 U1.3(RST#)
NetJ1_3: J1.3 R3.2
NetJ1_5: J1.5 R7.2
NetJ1_9: J1.9 R9.2
NetJ1_11: J1.11 R10.2
NetJ2_3: J2.3 R6.2
NetJ2_5: J2.5 R8.2
NetJ2_9: J2.9 R11.2
NetJ2_11: J2.11 R12.2
NetR16_2: R47.2 U8.20(CS_XM) ; port SOM_IMU_CS1#
NetR17_2: U8.21(SCL/SPC) ; port SOM_IMU_SCK
NetR18_2: R48.1 U8.22(SDO_G/SA0_G) ; port SOM_IMU_MISO
NetR22_2: R46.2 U8.19(CS_G) ; port SOM_IMU_CS2#
NetR24_2: U8.24(SDA) ; port SOM_IMU_MOSI
NetR28_1: R28.1 R33.2 U7.21(A0)
NetR29_1: R29.1 R34.2 U7.2(A1)
NetR30_1: R30.1 R35.2 U7.3(A2)
NetR48_2: R48.2 U8.23(SDO_XM/SA0_XM)
NetR81_1: U7.8(IO0_4) ; port VUSB_EN
NetR97_2: R97.2 TP5.1 U7.1(INT#)
NetTP1_1: TP1.1 U7.16(IO1_3)
NetTP2_1: TP2.1 U7.15(IO1_2)
NetTP3_1: TP3.1 U7.14(IO1_1)
NetTP4_1: TP4.1 U7.13(IO1_0)
NetTP6_1: TP6.1 U7.5(IO0_1)
NetTP7_1: TP7.1 U7.7(IO0_3)
NetTP8_1: TP8.1 U7.10(IO0_6)
NetTP12_1: TP12.1 U7.4(IO0_0)
NetTP13_1: TP13.1 U7.6(IO0_2)
NetTP14_1: TP14.1 U7.9(IO0_5)
NetTP15_1: TP15.1 U7.11(IO0_7)
NetTP17_1: TP17.1 U8.12(DRDY_G)
NetTP18_1: TP18.1 U8.11(INT_G)
NetTP19_1: TP19.1 U8.10(DEN_G)
NetTP20_1: TP20.1 U8.14(INT2_XM)
NetTP21_1: TP21.1 U8.13(INT1_XM)

Not connected (* = marked no-connect by the designer): D1 2(NC); U1 11(INT#)*; U3 6(OUT_2-) 7(OUT_2+); U6 6(OUT_2-) 7(OUT_2+); U8 1(RES)*

### Layout directives
differential pair: C0CLK_N, C0CLK_P, C0D0_N, C0D0_P, C0D1_N, C0D1_P, C0D2_N, C0D2_P, C0D3_N, C0D3_P, C1CLK_N, C1CLK_P, C1D0_N, C1D0_P, C1D1_N, C1D1_P, MIPI_CSI0_CLK_N, MIPI_CSI0_CLK_P, MIPI_CSI0_D0_N, MIPI_CSI0_D0_P, MIPI_CSI0_D1_N, MIPI_CSI0_D1_P, MIPI_CSI0_D2_N, MIPI_CSI0_D2_P, MIPI_CSI0_D3_N, MIPI_CSI0_D3_P, MIPI_CSI1_CLK_N, MIPI_CSI1_CLK_P, MIPI_CSI1_D0_N, MIPI_CSI1_D0_P, MIPI_CSI1_D1_N, MIPI_CSI1_D1_P
net class SOM_MCAM: MIPI_CSI0_CLK_N, MIPI_CSI0_CLK_P, MIPI_CSI0_D0_N, MIPI_CSI0_D0_P, MIPI_CSI0_D1_N, MIPI_CSI0_D1_P, MIPI_CSI0_D2_N, MIPI_CSI0_D2_P, MIPI_CSI0_D3_N, MIPI_CSI0_D3_P
net class SOM_SCAM: MIPI_CSI1_CLK_N, MIPI_CSI1_CLK_P, MIPI_CSI1_D0_N, MIPI_CSI1_D0_P, MIPI_CSI1_D1_N, MIPI_CSI1_D1_P
net class SCAM: C1CLK_N, C1CLK_P, C1D0_N, C1D0_P, C1D1_N, C1D1_P
net class MCAM: C0CLK_N, C0CLK_P, C0D0_N, C0D0_P, C0D1_N, C0D1_P, C0D2_N, C0D2_P, C0D3_N, C0D3_P
net class DIFF90: C0CLK_N, C0CLK_P, C0D0_N, C0D0_P, C0D1_N, C0D1_P, C0D2_N, C0D2_P, C0D3_N, C0D3_P, C1CLK_N, C1CLK_P, C1D0_N, C1D0_P, C1D1_N, C1D1_P, MIPI_CSI0_CLK_N, MIPI_CSI0_CLK_P, MIPI_CSI0_D0_N, MIPI_CSI0_D0_P, MIPI_CSI0_D1_N, MIPI_CSI0_D1_P, MIPI_CSI0_D2_N, MIPI_CSI0_D2_P, MIPI_CSI0_D3_N, MIPI_CSI0_D3_P, MIPI_CSI1_CLK_N, MIPI_CSI1_CLK_P, MIPI_CSI1_D0_N, MIPI_CSI1_D0_P, MIPI_CSI1_D1_N, MIPI_CSI1_D1_P

### Notes on the sheet
- (near U7) I2C ADDRESS 0b0100000x

### Library data of the parts
C1-C4 = CMP-1036-04917-1: as C7 on sheet 1 - SOM; Max Thickness: 1 mm; Tolerance: Â±10%; Technology: SMT; Rated Voltage: 6.3 V
C9 = CMP-1036-04520-1: CAP 220nF 6.3V Â±20% 0805 (2012 Metric) Thickness 1mm SMD; Case-Metric: 2012; Case-EIA: 0805; Technology: SMT; Tolerance: Â±20%; Max Thickness: 1 mm; Rated Voltage: 6.3 V
C10 = CMP-1036-04879-1: CAP 4.7uF 6.3V Â±20% 0805 (2012 Metric) Thickness 1mm SMD; Case-Metric: 2012; Case-EIA: 0805; Max Thickness: 1 mm; Technology: SMT; Tolerance: Â±20%; Rated Voltage: 6.3 V
C57 C58 C61 C62 = CMP-1036-04391-1: as C6 on sheet 1 - SOM; Rated Voltage: 6.3 V; Technology: SMT; Tolerance: Â±10%; Max Thickness: 1 mm
C59 C60 C63 = CMP-1036-04730-1: as C5 on sheet 1 - SOM; Technology: SMT; Tolerance: Â±5%; Max Thickness: 1 mm; Rated Voltage: 6.3 V
D1 = CMP-1054-00123-1: High-Speed Switching Diode, 3-Pin SOT-23, Pb-Free, Tape and Reel; Manufacturer: On Semiconductor; IF Max (A): 0.2; Configuration: Single; trr Max (ns): 4; PackageVersion: Rev. AP, 11/2009; ComponentLink2Description: Datasheet; ComponentLink1URL: http://www.onsemi.com/; DatasheetVersion: Rev. 7; RoHS: TRUE; ComponentLink2URL: http://www.onsemi.cn/pub_link/Collateral/MMBD914LT1-D.PDF; PackageReference: SOT-23-3-318-08; ComponentLink1Description: Manufacturer URL; Packing: Tape and Reel; PartNumber: MMBD914LT1G; PackageDescription: 3-Pin Small Outline Transistor, Body 2.92 x 1.3 mm, Pitch 0.95 mm; Mounting Technology: Surface Mount; ComponentLink3Description: Package Specification; ComponentLink3URL: http://www.onsemi.cn/pub_link/Collateral/318-08.PDF
R1 R2 = CMP-0280-00002-2: as R13 on sheet 1 - SOM; ComponentLink1Description: Manufacturer URL; Operating Temperature Range: -40 to 85 degC; ComponentLink2URL: http://www.bourns.com/data/global/pdfs/mfmsmf.pdf; PackageReference: MF-MSMF050; ComponentLink2Description: Datasheet; PartNumber: MF-MSMF050; DatasheetVersion: Rev. AD; ComponentLink3URL: http://www.bourns.com/data/global/pdfs/mfmsmf.pdf; ComponentLink3Description: Package Specification; RoHS: TRUE; PackageDescription: 2-Pin SMD, Body 4.55 x 3.24 mm; Mounting Technology: Surface Mount; Packing: Reel; Resistance (Min): 0.15 Ohm; ComponentLink1URL: http://www.bourns.com/
R3 R6-R12 R48 = CMP-1013-00341-1: 33R 0.125W 1% 0805 (2012 Metric)  SMD; Case-EIA: 0805; Case-Metric: 2012; Technology: SMT; Power: 0.125 W; Tolerance: 1 %
R4 R5 R14 R15 R19 R20 = CMP-1013-00586-1: 4K7 0.125W 1% 0805 (2012 Metric)  SMD; Case-Metric: 2012; Case-EIA: 0805; Technology: SMT; Power: 0.125 W; Tolerance: 1 %
R28-R30 R33-R35 R46 R47 R90 = CMP-1013-00623-1: as R16 on sheet 1 - SOM; Tolerance: 1 %; Power: 0.125 W; Technology: SMT
R97 = CMP-1013-00623-1: Case-Metric: 2012; Case-EIA: 0805; Tolerance: 1 %; Power: 0.125 W; Value: 10k; Technology: SMT
TP1-TP8 TP12-TP15 TP17-TP21 = TESTPOINTHOLE035
U1 = TCA9543A: Low Voltage 2-Channel I2C Bus Switch with Interrupt and Reset
U2-U6 = CMP-1066-00059-1: Common Mode Filter with ESD Protection, -40 to 85 degC, 10-Pin WDFN, Pb-Free, Tape and Reel; Manufacturer: On Semiconductor; C Typ (pF): 0.8; VRWM Max (V): 5; Number of Lines: 4; PackageDescription: 10-Pin Small Outline No-Lead, Body 2.5 x 2 mm, Pitch 0.5 mm; ComponentLink1URL: http://www.onsemi.com/; ComponentLink2Description: Datasheet; ComponentLink3Description: Package Specification; ComponentLink2URL: http://www.onsemi.cn/pub_link/Collateral/EMI4182-D.PDF; ComponentLink1Description: Manufacturer URL; PackageVersion: Rev. O, 06/2010; Packing: Tape and Reel; RoHS: Pb-Free; Mounting Technology: Surface Mount; ComponentLink3URL: http://www.onsemi.cn/pub_link/Collateral/511BM.PDF; DatasheetVersion: Rev. 1; PackageReference: WDFN-10-511BM-01; PartNumber: EMI4182MTTAG
U7 = PCA9555SSOP24
U8 = CMP-1273-00002-1: INEMO Inertial Module: 3D Accelerometer, 3D Gyroscope, 3D Magnetometer, 2.4 to 3.6 V, -40 to 85 degC, 24-Pin LGA, RoHS, Tape and Reel; Manufacturer: STMicroelectronics; VDDIO: 1.71 V Min.; IDD_XM: 350 uA Typ.; IDD_G_LP: 2 mA Typ.; IDD_G: 6.1 mA Typ.; IDD_PDN: 6 uA Typ.; Bandwidth: 400 kHz; DatasheetVersion: Rev. 2; PartNumber: LSM9DS0TR; ComponentLink2URL: http://www.st.com/st-web-ui/static/active/en/resource/technical/document/datasheet/DM00087365.pdf; ComponentLink3Description: Package Specification; Packing: Tape and Reel; ComponentLink3URL: http://www.st.com/st-web-ui/static/active/en/resource/technical/document/datasheet/DM00087365.pdf; Mounting Technology: Surface Mount; ComponentLink1Description: Manufacturer URL; RoHS: TRUE; Operating Temperature Range: -40 to 85 degC; VDD: 2.4 to 3.6 V; ComponentLink1URL: http://www.st.com/; PackageDescription: 24-Pin Land Grid Array, Body 4 x 4 mm, Pitch 0.5 mm; ComponentLink2Description: Datasheet

## Sheet 3 - USB.SchDoc
size Tabloid
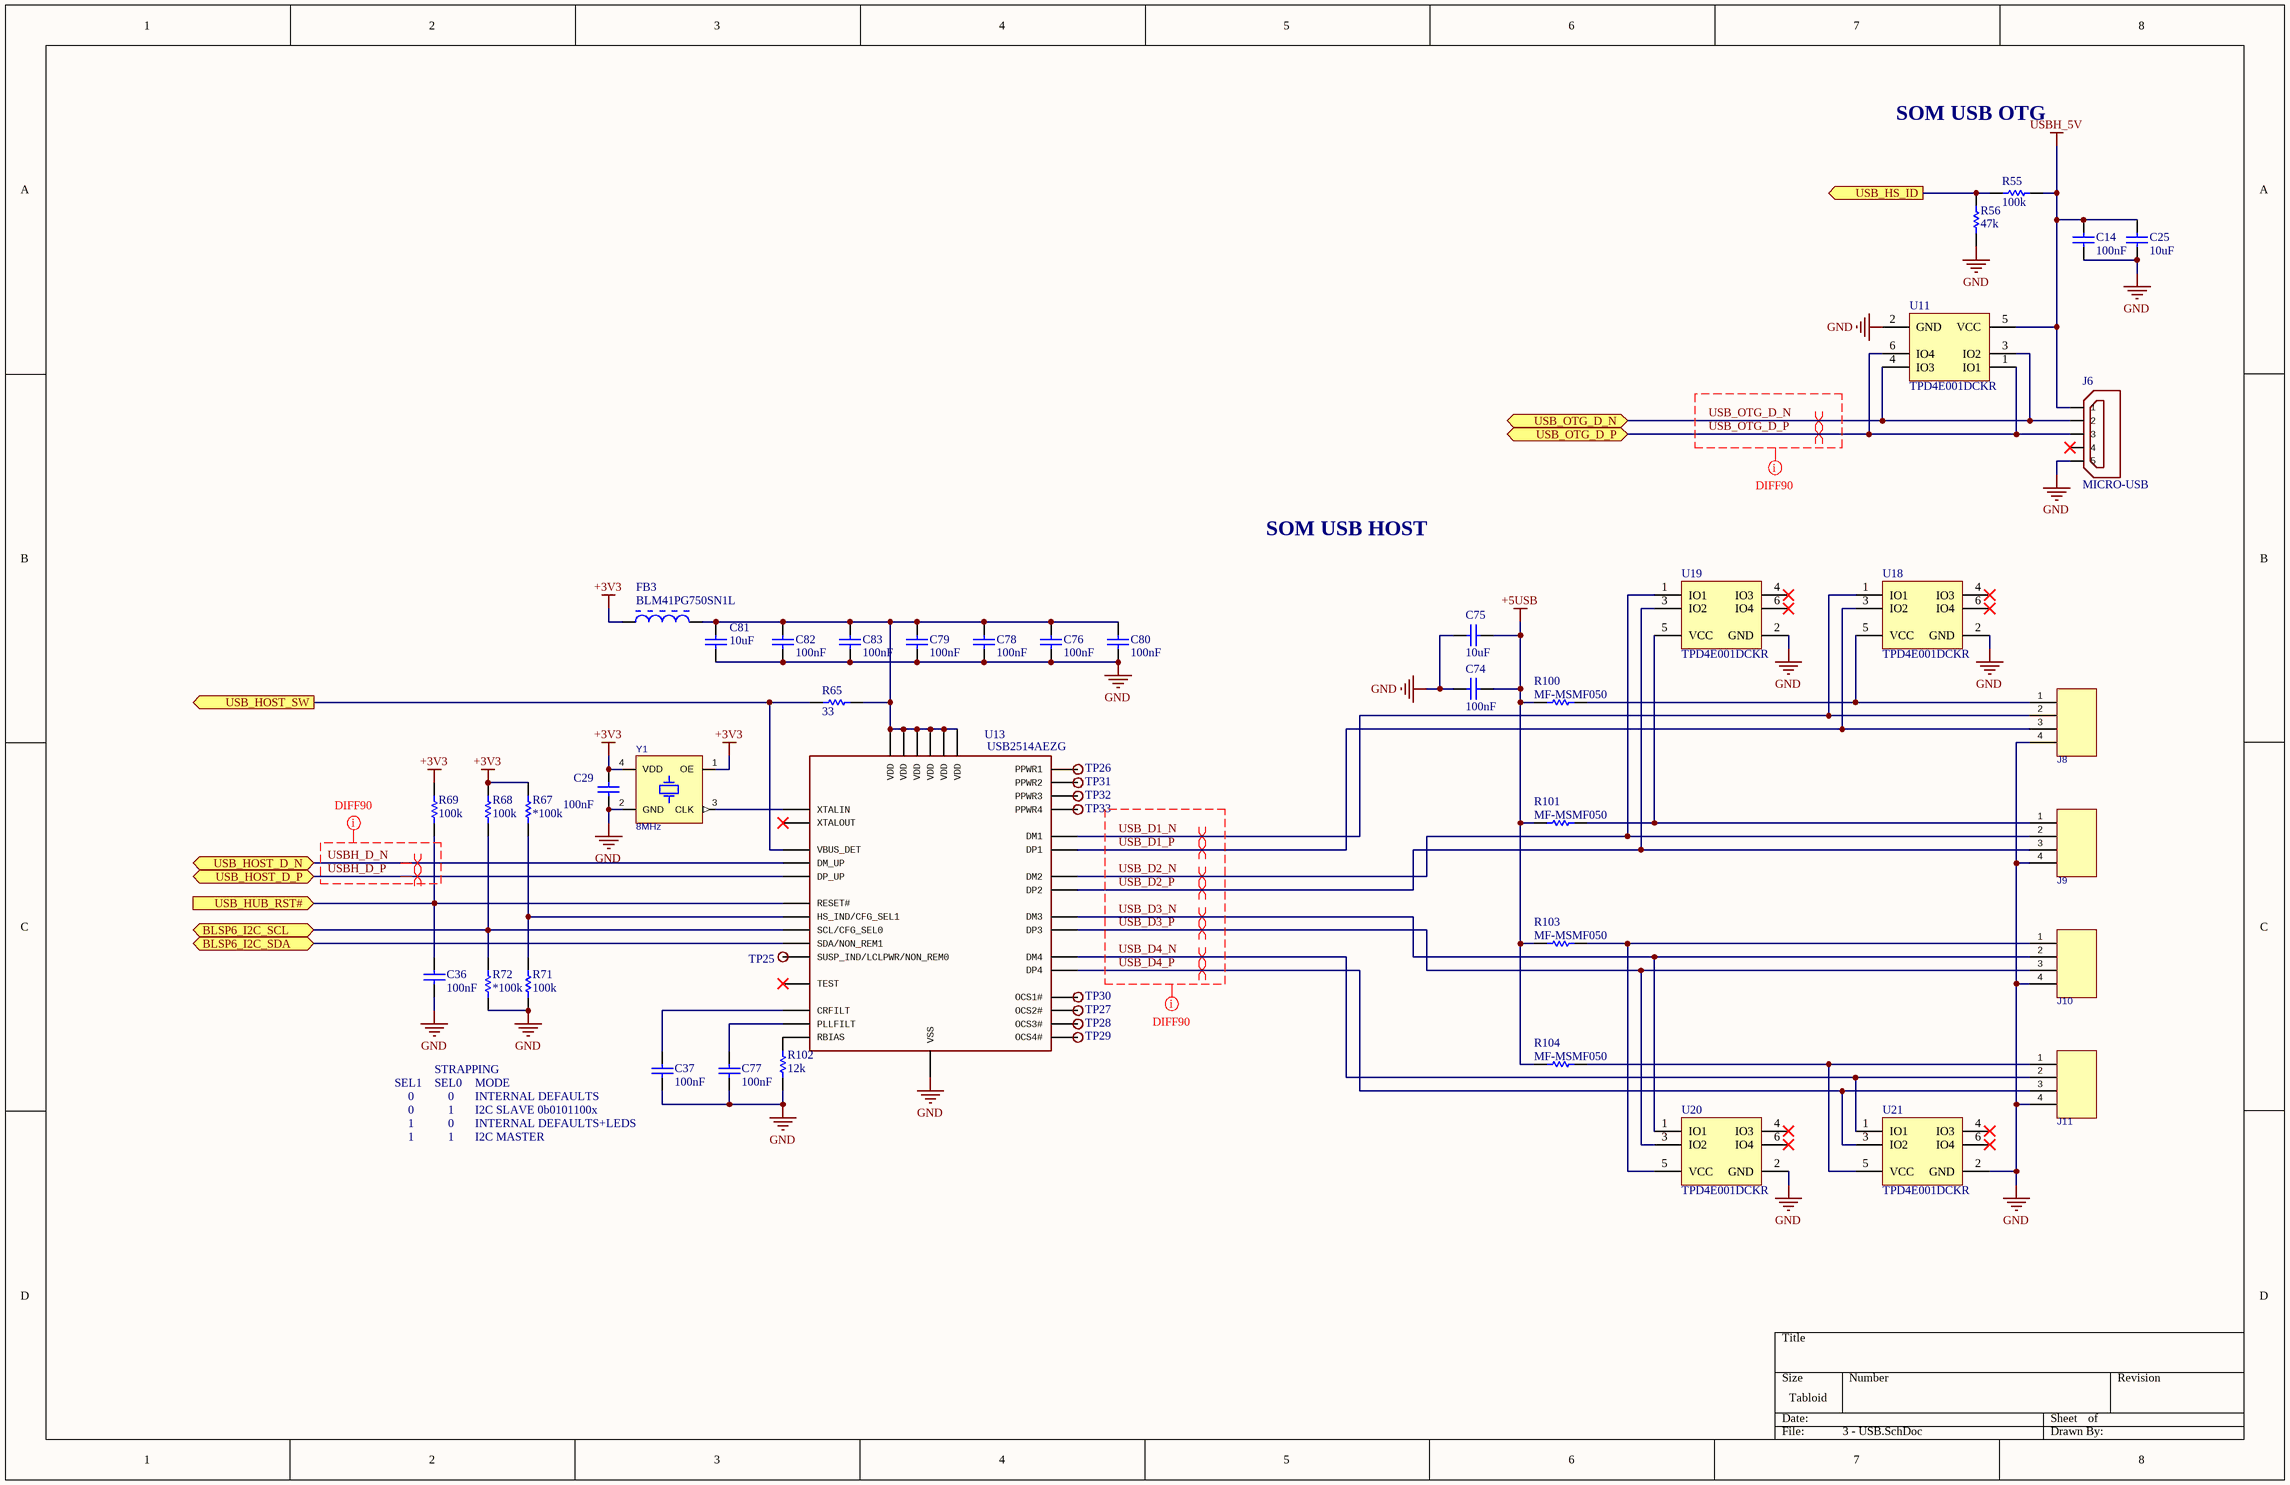
[diagram p2: 3 - USB.SchDoc]

### Parts
C14  value 100nF  [CAPC0805(2012)100_L]  (hidden comment: CAP 100nF 6.3V 0805(2012))
C25  value 10uF  [CAPC0805(2012)100_L]  (hidden comment: CAP 10uF 6.3V 0805(2012))
C29  value 100nF  [CAPC0805(2012)100_L]  (hidden comment: CAP 100nF 6.3V 0805(2012))
C36  value 100nF  [CAPC0805(2012)100_L]  (hidden comment: CAP 100nF 6.3V 0805(2012))
C37  value 100nF  [CAPC0805(2012)100_L]  (hidden comment: CAP 100nF 6.3V 0805(2012))
C74  value 100nF  [CAPC0805(2012)100_L]  (hidden comment: CAP 100nF 6.3V 0805(2012))
C75  value 10uF  [CAPC0805(2012)100_L]  (hidden comment: CAP 10uF 6.3V 0805(2012))
C76  value 100nF  [CAPC0805(2012)100_L]  (hidden comment: CAP 100nF 6.3V 0805(2012))
C77  value 100nF  [CAPC0805(2012)100_L]  (hidden comment: CAP 100nF 6.3V 0805(2012))
C78  value 100nF  [CAPC0805(2012)100_L]  (hidden comment: CAP 100nF 6.3V 0805(2012))
C79  value 100nF  [CAPC0805(2012)100_L]  (hidden comment: CAP 100nF 6.3V 0805(2012))
C80  value 100nF  [CAPC0805(2012)100_L]  (hidden comment: CAP 100nF 6.3V 0805(2012))
C81  value 10uF  [CAPC0805(2012)100_L]  (hidden comment: CAP 10uF 6.3V 0805(2012))
C82  value 100nF  [CAPC0805(2012)100_L]  (hidden comment: CAP 100nF 6.3V 0805(2012))
C83  value 100nF  [CAPC0805(2012)100_L]  (hidden comment: CAP 100nF 6.3V 0805(2012))
FB3  BLM41PG750SN1L  [MURA-BLM41-B35-CHIP-2_V2]
J6  MICRO-USB  [USB_MICRO_B_SMT]
J8  DF13-4P-1.25DS(20)  [HRS_DF13-4P-1.25DS(20)]  (value not drawn)
J9  DF13-4P-1.25DS(20)  [HRS_DF13-4P-1.25DS(20)]  (value not drawn)
J10  DF13-4P-1.25DS(20)  [HRS_DF13-4P-1.25DS(20)]  (value not drawn)
J11  DF13-4P-1.25DS(20)  [HRS_DF13-4P-1.25DS(20)]  (value not drawn)
R55  100k  [RESC0805(2012)_L]
R56  value 47k  [RESC0805(2012)_L]  (hidden comment: 47K 1% 0805(2012))
R65  value 33  [RESC0805(2012)_L]  (hidden comment: 33R 1% 0805(2012))
R67  value *100k  [RESC0805(2012)_L]  (hidden comment: 100k)
R68  100k  [RESC0805(2012)_L]
R69  100k  [RESC0805(2012)_L]
R71  100k  [RESC0805(2012)_L]
R72  value *100k  [RESC0805(2012)_L]  (hidden comment: 100k)
R100  MF-MSMF050  [BOUR-MF-MSMF050-2_V]
R101  MF-MSMF050  [BOUR-MF-MSMF050-2_V]
R102  12k  [RESC0805(2012)_L]
R103  MF-MSMF050  [BOUR-MF-MSMF050-2_V]
R104  MF-MSMF050  [BOUR-MF-MSMF050-2_V]
TP25  Various test points  [VIAHOLE20]  (value not drawn)
TP26  Various test points  [VIAHOLE20]  (value not drawn)
TP27  Various test points  [VIAHOLE20]  (value not drawn)
TP28  Various test points  [VIAHOLE20]  (value not drawn)
TP29  Various test points  [VIAHOLE20]  (value not drawn)
TP30  Various test points  [VIAHOLE20]  (value not drawn)
TP31  Various test points  [VIAHOLE20]  (value not drawn)
TP32  Various test points  [VIAHOLE20]  (value not drawn)
TP33  Various test points  [VIAHOLE20]  (value not drawn)
U11  TPD4E001DCKR  [DCK0006A_M]
U13  USB2514AEZG  [QFN36]
U18  TPD4E001DCKR  [DCK0006A_M]
U19  TPD4E001DCKR  [DCK0006A_M]
U20  TPD4E001DCKR  [DCK0006A_M]
U21  TPD4E001DCKR  [DCK0006A_M]
Y1  8MHz  [OSC_DFN165P250X90-4N]

### Ports
BLSP6_I2C_SCL (bidir), BLSP6_I2C_SDA (bidir), USB_HOST_D_N, USB_HOST_D_P, USB_HOST_SW (out), USB_HS_ID (out), USB_HUB_RST# (in), USB_OTG_D_N, USB_OTG_D_P

### Nets
+3V3: C29.1 FB3.1 R67.2 R68.2 R69.2 Y1.1(OE) Y1.4(VDD)
+5USB: C74.1 C75.2 R100.1 R101.1 R103.1 R104.1
GND: C14.2 C25.2 C29.2 C36.1 C37.1 C74.2 C75.1 C76.1 C77.1 C78.1 C79.1 C80.1 C81.1 C82.1 C83.1 J6.ID(5) J8.4 J9.4 J10.4 J11.4 R56.1 R71.1 R72.1 R102.1 U11.2(GND) U13.PAD(VSS) U18.2(GND) U19.2(GND) U20.2(GND) U21.2(GND) Y1.2(GND)
USBH_5V: C14.1 C25.1 J6.VBUS(1) R55.1 U11.5(VCC)
BLSP6_I2C_SCL: R68.1 R72.2 U13.24(SCL/CFG_SEL0) ; port BLSP6_I2C_SCL
BLSP6_I2C_SDA: U13.22(SDA/NON_REM1) ; port BLSP6_I2C_SDA
USB_D1_N: J8.2 U13.1(DM1) U18.1(IO1)
USB_D1_P: J8.3 U13.2(DP1) U18.3(IO2)
USB_D2_N: J9.2 U13.3(DM2) U19.1(IO1)
USB_D2_P: J9.3 U13.4(DP2) U19.3(IO2)
USB_D3_N: J10.2 U13.6(DM3) U20.1(IO1)
USB_D3_P: J10.3 U13.7(DP3) U20.3(IO2)
USB_D4_N: J11.2 U13.8(DM4) U21.1(IO1)
USB_D4_P: J11.3 U13.9(DP4) U21.3(IO2)
USB_HOST_SW: R65.2 U13.27(VBUS_DET) ; port USB_HOST_SW
USB_HS_ID: R55.2 R56.2 ; port USB_HS_ID
USB_HUB_RST#: C36.2 R69.1 U13.26(RESET#) ; port USB_HUB_RST#
USB_OTG_D_N: J6.D-(2) U11.3(IO2) U11.4(IO3) ; port USB_OTG_D_N
USB_OTG_D_P: J6.D+(3) U11.1(IO1) U11.6(IO4) ; port USB_OTG_D_P
USBH_D_N: U13.30(DM_UP) ; port USB_HOST_D_N  [project net USB_HOST_D_N]
USBH_D_P: U13.31(DP_UP) ; port USB_HOST_D_P  [project net USB_HOST_D_P]
NetC37_2: C37.2 U13.14(CRFILT)
NetC76_2: C76.2 C78.2 C79.2 C80.2 C81.2 C82.2 C83.2 FB3.2 R65.1 U13.5(VDD) U13.10(VDD) U13.15(VDD) U13.23(VDD) U13.29(VDD) U13.36(VDD)
NetC77_2: C77.2 U13.34(PLLFILT)
NetJ8_1: J8.1 R100.2 U18.5(VCC)
NetJ9_1: J9.1 R101.2 U19.5(VCC)
NetJ10_1: J10.1 R103.2 U20.5(VCC)
NetJ11_1: J11.1 R104.2 U21.5(VCC)
NetR67_1: R67.1 R71.2 U13.25(HS_IND/CFG_SEL1)
NetR102_2: R102.2 U13.35(RBIAS)
NetTP25_1: TP25.1 U13.28(SUSP_IND/LCLPWR/NON_REM0)
NetTP26_1: TP26.1 U13.12(PPWR1)
NetTP27_1: TP27.1 U13.17(OCS2#)
NetTP28_1: TP28.1 U13.19(OCS3#)
NetTP29_1: TP29.1 U13.21(OCS4#)
NetTP30_1: TP30.1 U13.13(OCS1#)
NetTP31_1: TP31.1 U13.16(PPWR2)
NetTP32_1: TP32.1 U13.18(PPWR3)
NetTP33_1: TP33.1 U13.20(PPWR4)
NetU13_33: U13.33(XTALIN) Y1.3(CLK)

Not connected (* = marked no-connect by the designer): J6 GND(4)*; U13 11(TEST)* 32(XTALOUT)*; U18 4(IO3)* 6(IO4)*; U19 4(IO3)* 6(IO4)*; U20 4(IO3)* 6(IO4)*; U21 4(IO3)* 6(IO4)*

### Layout directives
differential pair: USB_D1_N, USB_D1_P, USB_D2_N, USB_D2_P, USB_D3_N, USB_D3_P, USB_D4_N, USB_D4_P, USB_HOST_D_N, USB_HOST_D_P, USB_OTG_D_N, USB_OTG_D_P
net class DIFF90: USB_D1_N, USB_D1_P, USB_D2_N, USB_D2_P, USB_D3_N, USB_D3_P, USB_D4_N, USB_D4_P, USB_OTG_D_N, USB_OTG_D_P, USBH_D_N, USBH_D_P

### Notes on the sheet
- SOM USB OTG
- SOM USB HOST
- SEL1
- 0
- STRAPPING
- SEL0
- INTERNAL DEFAULTS
- MODE
- 1
- I2C SLAVE 0b0101100x
- INTERNAL DEFAULTS+LEDS
- I2C MASTER

### Library data of the parts
C14 C29 C36 C37 C74 C76-C80 C82 C83 = CMP-1036-04391-1: as C6 on sheet 1 - SOM; Rated Voltage: 6.3 V; Technology: SMT; Tolerance: Â±10%; Max Thickness: 1 mm
C25 C75 = CMP-1036-04917-1: as C7 on sheet 1 - SOM; Max Thickness: 1 mm; Tolerance: Â±10%; Technology: SMT; Rated Voltage: 6.3 V
C81 = CMP-1036-04920-1: CAP 10uF 6.3V Â±20% 0805 (2012 Metric) Thickness 1mm SMD; Case-Metric: 2012; Case-EIA: 0805; Max Thickness: 1 mm; Tolerance: Â±20%; Rated Voltage: 6.3 V; Technology: SMT
FB3 = CMP-0686-00749-2: Chip Ferrite Bead for Power Lines, 75 Ohm, 3500 mA, -55 to 125 degC, 4.5 x 1.6 x 1.8 mm SMD, Tape and Reel; Manufacturer: Murata; Rated Current: 3500 mA; Impedance (at 100 MHz): 75 Ohm Typ.; DC Resistance: 0.015 Ohm Max.; PackageReference: BLM41-2; Packing: Tape and Reel; PartNumber: BLM41PG750SN1L; ComponentLink1URL: http://www.murata.com/; ComponentLink3Description: Package Specification; ComponentLink1Description: Manufacturer URL; ComponentLink3URL: http://www.murata.com/products/catalog/pdf/c31e.pdf; DatasheetVersion: 08/2013; PackageDescription: 2-Pin Chip, Body 4.5 x 1.6 mm; Operating Temperature Range: -55 to 125 degC; Mounting Technology: Surface Mount; ComponentLink2URL: http://www.murata.com/products/catalog/pdf/c31e.pdf; ComponentLink2Description: Datasheet
J6 = MICRO-USB: pin to pad: D+>3 D->2 GND>4 ID>5 VBUS>1
J8-J11 = CON_HRS_DF13-4P-1.25DS(20): CONN HEADER 4POS 1.25MM R/A THT TIN; Manufacturer: Hirose Electric Co Ltd; Connector Type: Header, Shrouded; Number of Positions: 4; Number of Positions Loaded: All; Pitch: 0.049" (1.25mm); Supplier 1: Digi-Key; Manufacturer Part Number: DF13-4P-1.25DS(20); RoHS: RoHS Compliant; Category: Connectors, Interconnects; Stock 1: 6051; Pricing 1: 1=0.51, 10=0.48, 50=0.384, 100=0.368, 250=0.336, 500=0.32, 1000=0.264, 2500=0.24, 5000=0.232 (USD); Packaging: Tube; Contact Type: Male Pin; Number of Rows: 1; Row Spacing: -; Contact Mating Length: -; Mounting Type: Through Hole, Right Angle; Termination: Solder; Fastening Type: -; Features: Board Guide; Contact Finish: Tin; Contact Finish Thickness: -; Color: Beige; ComponentLink1URL: http://www.hirose.co.jp/cataloge_hp/2d/EDC3-081817-01.pdf; ComponentLink1Description: http://www.hirose.co.jp/cataloge_hp/2d/EDC3-081817-01.pdf; Supplier Part Number 1: H2201-ND
R55 R67-R69 R71 R72 R102 = CMP-1013-00623-1: as R16 on sheet 1 - SOM; Tolerance: 1 %; Power: 0.125 W; Technology: SMT
  R55 R68 R69 R71: Value: 100k
  R102: Value: 12k
R56 = CMP-1013-00699-1: 47K 0.125W 1% 0805 (2012 Metric)  SMD; Case-Metric: 2012; Case-EIA: 0805; Power: 0.125 W; Tolerance: 1 %; Technology: SMT
R65 = CMP-1013-00341-1: as R3 on sheet 2 - Peripherals; Technology: SMT; Power: 0.125 W; Tolerance: 1 %
R100 R101 R103 R104 = CMP-0280-00002-2: as R13 on sheet 1 - SOM; ComponentLink1Description: Manufacturer URL; Operating Temperature Range: -40 to 85 degC; ComponentLink2URL: http://www.bourns.com/data/global/pdfs/mfmsmf.pdf; PackageReference: MF-MSMF050; ComponentLink2Description: Datasheet; PartNumber: MF-MSMF050; DatasheetVersion: Rev. AD; ComponentLink3URL: http://www.bourns.com/data/global/pdfs/mfmsmf.pdf; ComponentLink3Description: Package Specification; RoHS: TRUE; PackageDescription: 2-Pin SMD, Body 4.55 x 3.24 mm; Mounting Technology: Surface Mount; Packing: Reel; Resistance (Min): 0.15 Ohm; ComponentLink1URL: http://www.bourns.com/
TP25-TP33 = TESTPOINTHOLE035
U11 U18-U21 = CMP-0326-00066-2: Low-Capacitance + / - 15-kV ESD Protection Array for High-Speed Data Interfaces, 4 Channels, -40 to +85 degC, 6-pin SOT70 (DCK), Green (RoHS & no Sb/Br); Manufacturer: Texas Instruments; IO Leakage Current(nA): 1.5; IEC 61000-4-2 Air-Gap(+/- kV): 15; USB High Speed: TRUE; SubFamily: ESD Solution; IEC 61000-4-2 Contact(+/- kV): 8; Breakdown Voltage(Min)(V): 11; Mounting Technology: Surface Mount; DatasheetVersion: SLLS682G; ComponentLink1URL: http://www.ti.com/; Serial ATA / eSATA: TRUE; PackageReference: DCK0006A; ComponentLink3Description: URL Link1; ComponentLink2Description: Datasheet; 1394 / Firewire: TRUE; ComponentLink2URL: http://www.ti.com/general/docs/lit/getliterature.tsp?genericPartNumber=TPD4E001&fileType=pdf; ComponentLink1Description: Manufacturer URL; PackageVersion: revG, Jan-2007; ComponentLink3URL: SamplesURL:http://www.ti.com/product/tpd4e001#samples; PackageDescription: 6-Pin Plastic Small-Outline Package, 2 x 1.3 mm Body, 0.65 mm Pitch, 2.1 mm Lead Span; IO Capacitance(Typ)(pF): 1.5; PartNumber: TPD4E001DCKR; Eco-Plan: Green (RoHS & no Sb/Br)
Y1 = OSC_MEMS_8.000MHZ: OSC CMEMS 8.000MHZ LVCMOS SMD; Manufacturer: Silicon Labs; Manufacturer Part Number: 501ABA8M00000DAG; Function: Tri-State (Output Enable); Voltage - Supply: 1.7 V ~ 3.6 V; Frequency Stability: ±30ppm; Current - Supply (Max): 2.5mA; Supplier 1: Digi-Key; RoHS: RoHS Compliant; Category: Crystals and Oscillators; Stock 1: 150; Pricing 1: 1=1.04, 10=0.92, 50=0.86, 100=0.76, 500=0.72, 1000=0.6, 2500=0.58, 5000=0.56 (USD); Packaging: Cut Strip; Type: CMEMS®; Frequency: 8MHz; Output: LVCMOS; Operating Temperature: -40°C ~ 85°C; Ratings: -; Mounting Type: Surface Mount; Size / Dimension: 0.098" L x 0.079" W (2.50mm x 2.00mm); Height: 0.035" (0.90mm); Package / Case: 4-SMD, No Lead (DFN, LCC); Current - Supply (Disable) (Max): 2.5mA; ComponentLink1URL: http://www.silabs.com/Support%20Documents/TechnicalDocs/Si501-2-3.pdf; ComponentLink1Description: http://www.silabs.com/Support%20Documents/TechnicalDocs/Si501-2-3.pdf; Supplier Part Number 1: 336-2873-ND

## Sheet 4 - Audio Amplifier.SchDoc
size Tabloid
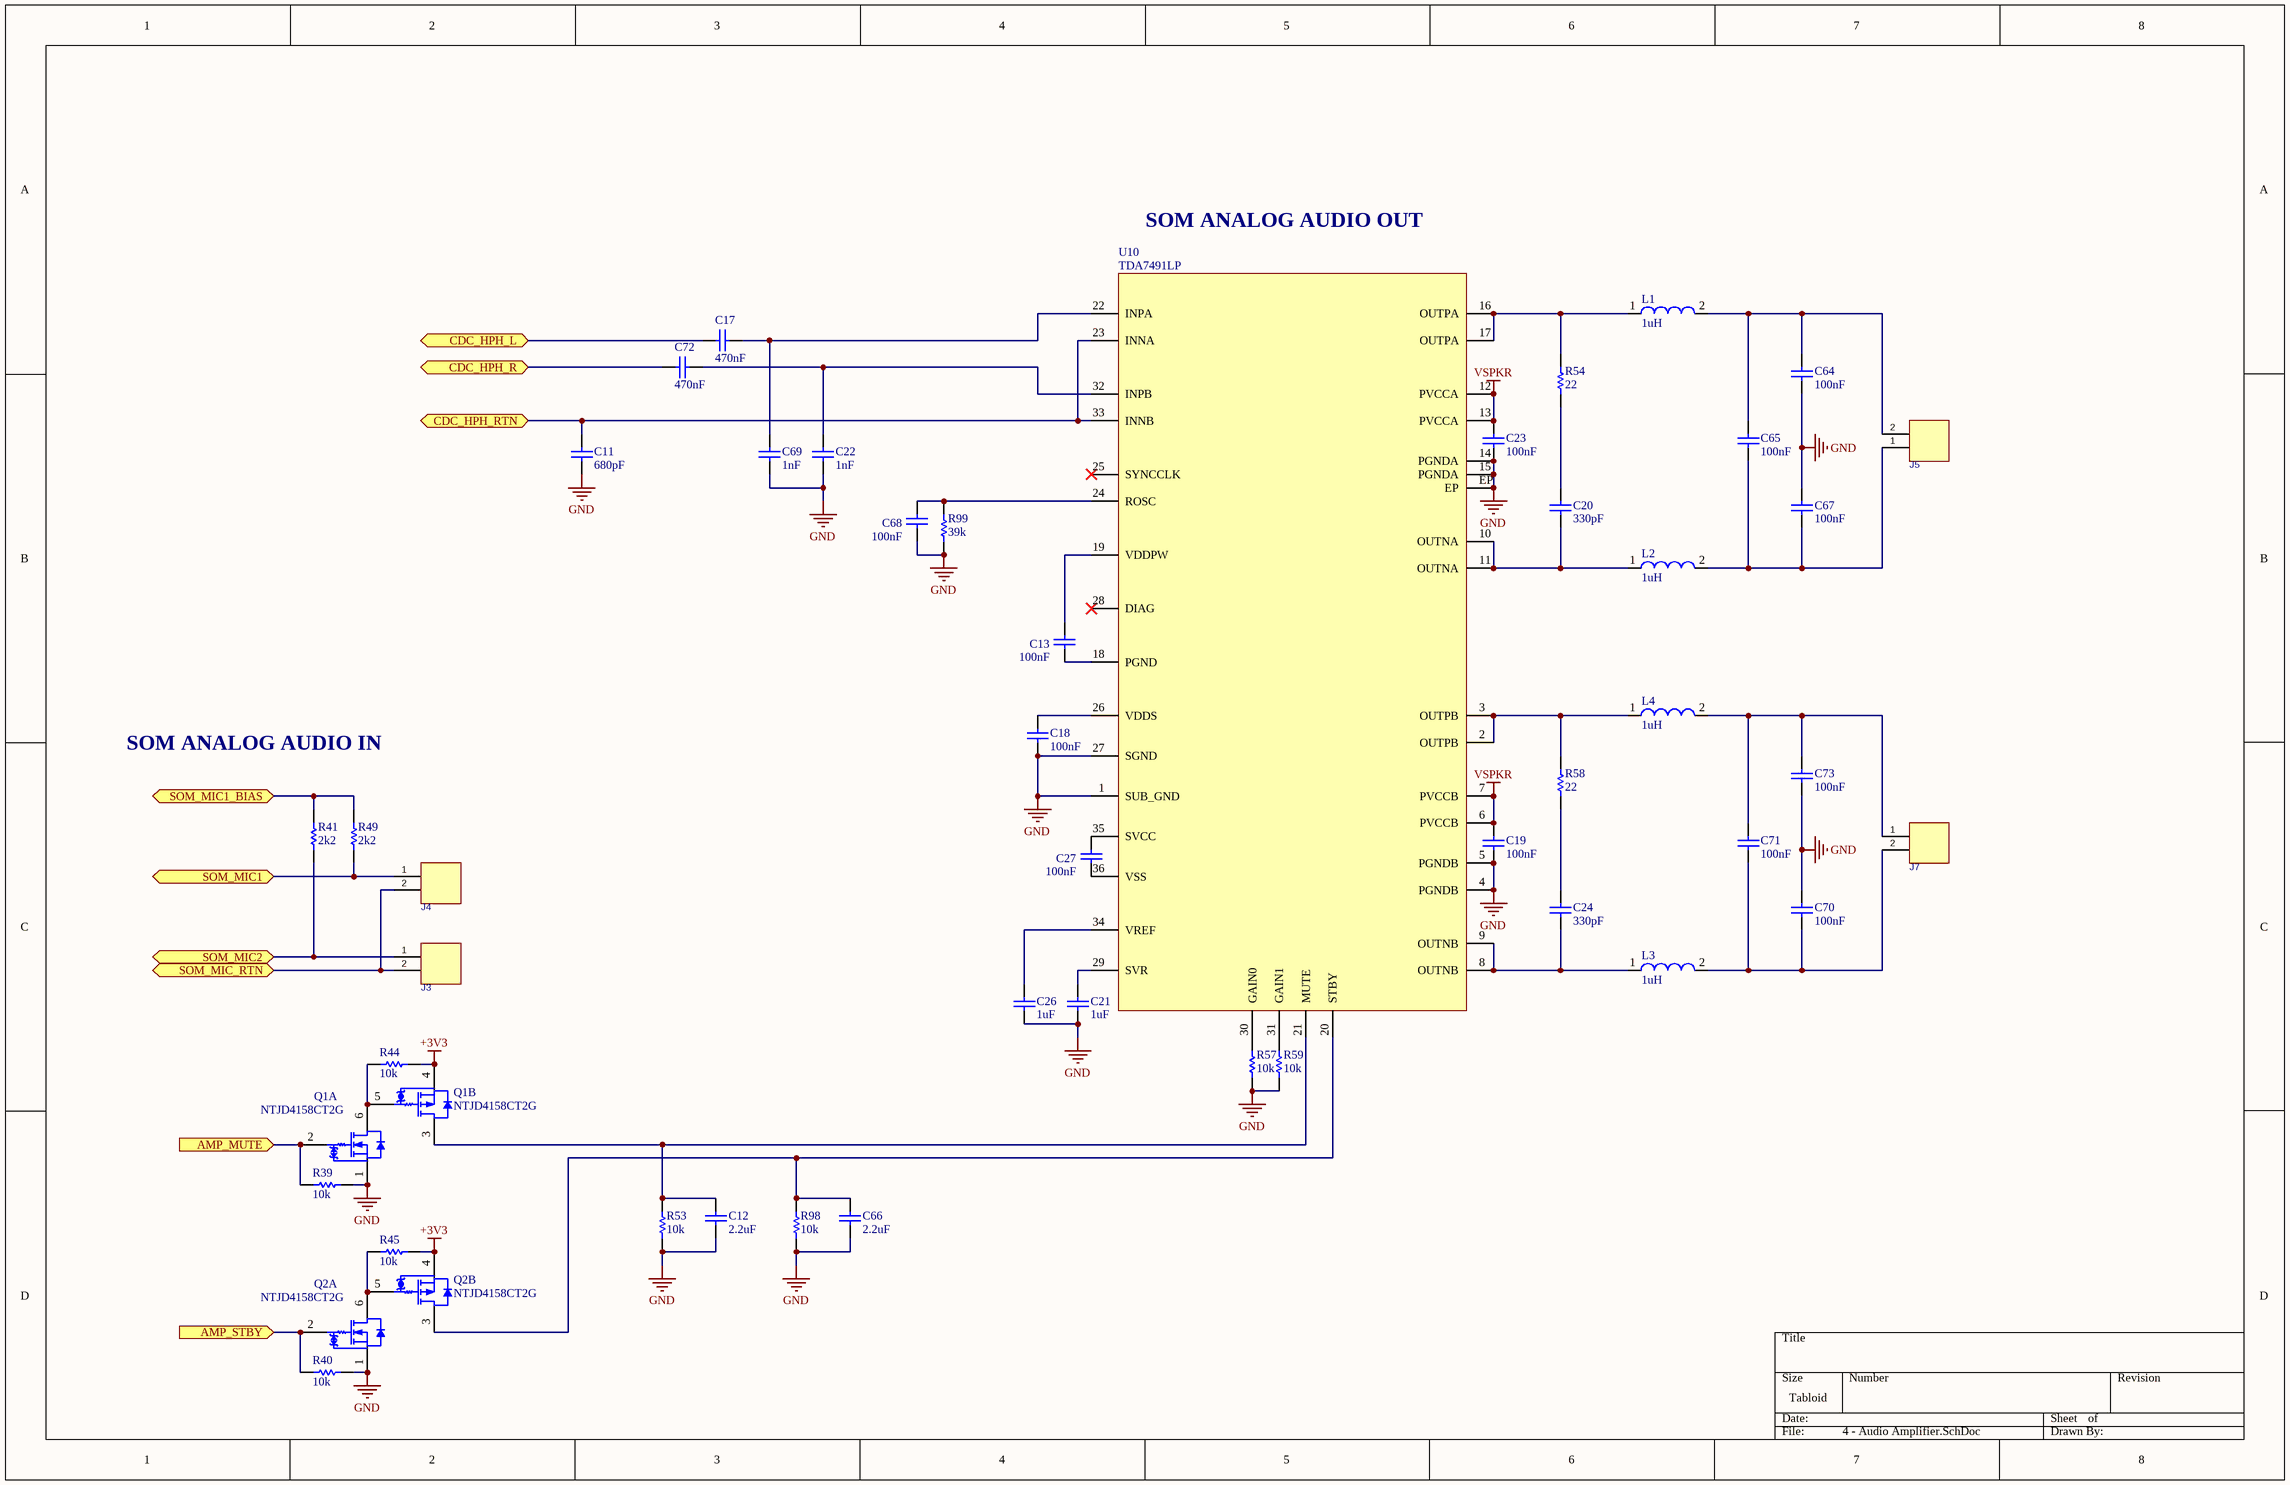
[diagram p3: 4 - Audio Amplifier.SchDoc]

### Parts
C11  value 680pF  [CAPC0805(2012)100_L]
C12  value 2.2uF  [CAPC0805(2012)145_L]  (hidden comment: CAP 22uF 16V 0805(2012))
C13  value 100nF  [CAPC0805(2012)100_L]  (hidden comment: CAP 100nF 25V 0805(2012))
C17  value 470nF  [CAPC0805(2012)100_L]
C18  value 100nF  [CAPC0805(2012)100_L]  (hidden comment: CAP 100nF 25V 0805(2012))
C19  value 100nF  [CAPC0805(2012)100_L]  (hidden comment: CAP 100nF 25V 0805(2012))
C20  value 330pF  [CAPC0805(2012)100_L]
C21  value 1uF  [CAPC0805(2012)145_L]  (hidden comment: CAP 22uF 16V 0805(2012))
C22  value 1nF  [CAPC0805(2012)100_L]
C23  value 100nF  [CAPC0805(2012)100_L]  (hidden comment: CAP 100nF 25V 0805(2012))
C24  value 330pF  [CAPC0805(2012)100_L]
C26  value 1uF  [CAPC0805(2012)145_L]  (hidden comment: CAP 22uF 16V 0805(2012))
C27  value 100nF  [CAPC0805(2012)100_L]  (hidden comment: CAP 100nF 25V 0805(2012))
C64  value 100nF  [CAPC0805(2012)100_L]  (hidden comment: CAP 100nF 25V 0805(2012))
C65  value 100nF  [CAPC0805(2012)100_L]  (hidden comment: CAP 100nF 25V 0805(2012))
C66  value 2.2uF  [CAPC0805(2012)145_L]  (hidden comment: CAP 22uF 16V 0805(2012))
C67  value 100nF  [CAPC0805(2012)100_L]  (hidden comment: CAP 100nF 25V 0805(2012))
C68  value 100nF  [CAPC0805(2012)100_L]  (hidden comment: CAP 100nF 25V 0805(2012))
C69  value 1nF  [CAPC0805(2012)100_L]
C70  value 100nF  [CAPC0805(2012)100_L]  (hidden comment: CAP 100nF 25V 0805(2012))
C71  value 100nF  [CAPC0805(2012)100_L]  (hidden comment: CAP 100nF 25V 0805(2012))
C72  value 470nF  [CAPC0805(2012)100_L]
C73  value 100nF  [CAPC0805(2012)100_L]  (hidden comment: CAP 100nF 25V 0805(2012))
J3  DF13-2P-1.25DS(20)  [HRS_DF13-2P-1.25DS(20)]  (value not drawn)
J4  DF13-2P-1.25DS(20)  [HRS_DF13-2P-1.25DS(20)]  (value not drawn)
J5  DF13-2P-1.25DS(20)  [HRS_DF13-2P-1.25DS(20)]  (value not drawn)
J7  DF13-2P-1.25DS(20)  [HRS_DF13-2P-1.25DS(20)]  (value not drawn)
L1  1uH  [SMD 0805_A]
L2  1uH  [SMD 0805_A]
L3  1uH  [SMD 0805_A]
L4  1uH  [SMD 0805_A]
Q1  NTJD4158CT2G  [ONSC-SC70-6-419B-02_W_V]  (parts A,B of 2)
Q2  NTJD4158CT2G  [ONSC-SC70-6-419B-02_W_V]  (parts A,B of 2)
R39  value 10k  [RESC0805(2012)_L]  (hidden comment: 10K 1% 0805(2012))
R40  value 10k  [RESC0805(2012)_L]  (hidden comment: 10K 1% 0805(2012))
R41  value 2k2  [RESC0805(2012)_L]
R44  value 10k  [RESC0805(2012)_L]  (hidden comment: 10K 1% 0805(2012))
R45  value 10k  [RESC0805(2012)_L]  (hidden comment: 10K 1% 0805(2012))
R49  value 2k2  [RESC0805(2012)_L]
R53  value 10k  [RESC0805(2012)_L]  (hidden comment: 10K 1% 0805(2012))
R54  value 22  [RESC0805(2012)_L]
R57  value 10k  [RESC0805(2012)_L]  (hidden comment: 10K 1% 0805(2012))
R58  value 22  [RESC0805(2012)_L]
R59  value 10k  [RESC0805(2012)_L]  (hidden comment: 10K 1% 0805(2012))
R98  value 10k  [RESC0805(2012)_L]  (hidden comment: 10K 1% 0805(2012))
R99  value 39k  [RESC0805(2012)_L]
U10  TDA7491LP  [POWERSSO-36]

### Ports
AMP_MUTE (in), AMP_STBY (in), CDC_HPH_L, CDC_HPH_R, CDC_HPH_RTN, SOM_MIC1, SOM_MIC1_BIAS, SOM_MIC2, SOM_MIC_RTN

### Nets
+3V3: Q1.4(S2) Q2.4(S2) R44.2 R45.2
GND: C11.1 C12.1 C18.2 C19.1 C21.1 C22.1 C23.1 C26.1 C64.1 C66.1 C67.2 C68.1 C69.1 C70.2 C73.1 Q1.1(S1) Q2.1(S1) R39.2 R40.2 R53.1 R57.2 R59.2 R98.1 R99.1 U10.1(SUB_GND) U10.4(PGNDB) U10.5(PGNDB) U10.14(PGNDA) U10.15(PGNDA) U10.27(SGND) U10.EP
VSPKR: C19.2 C23.2 U10.6(PVCCB) U10.7(PVCCB) U10.12(PVCCA) U10.13(PVCCA)
AMP_MUTE: Q1.2(G1) R39.1 ; port AMP_MUTE
AMP_STBY: Q2.2(G1) R40.1 ; port AMP_STBY
CDC_HPH_L: C17.2 ; port CDC_HPH_L
CDC_HPH_R: C72.2 ; port CDC_HPH_R
CDC_HPH_RTN: C11.2 U10.23(INNA) U10.33(INNB) ; port CDC_HPH_RTN
SOM_MIC1: J4.1 R49.2 ; port SOM_MIC1
SOM_MIC1_BIAS: R41.1 R49.1 ; port SOM_MIC1_BIAS
SOM_MIC2: J3.1 R41.2 ; port SOM_MIC2
SOM_MIC_RTN: J3.2 J4.2 ; port SOM_MIC_RTN
NetC12_2: C12.2 Q1.3(D2) R53.2 U10.21(MUTE)
NetC13_1: C13.1 U10.18(PGND)
NetC13_2: C13.2 U10.19(VDDPW)
NetC17_1: C17.1 C69.2 U10.22(INPA)
NetC18_1: C18.1 U10.26(VDDS)
NetC20_1: C20.1 L2.1 U10.10(OUTNA) U10.11(OUTNA)
NetC20_2: C20.2 R54.1
NetC21_2: C21.2 U10.29(SVR)
NetC22_2: C22.2 C72.1 U10.32(INPB)
NetC24_1: C24.1 L3.1 U10.8(OUTNB) U10.9(OUTNB)
NetC24_2: C24.2 R58.1
NetC26_2: C26.2 U10.34(VREF)
NetC27_1: C27.1 U10.36(VSS)
NetC27_2: C27.2 U10.35(SVCC)
NetC64_2: C64.2 C65.2 J5.2 L1.2
NetC65_1: C65.1 C67.1 J5.1 L2.2
NetC66_2: C66.2 Q2.3(D2) R98.2 U10.20(STBY)
NetC68_2: C68.2 R99.2 U10.24(ROSC)
NetC70_1: C70.1 C71.1 J7.2 L3.2
NetC71_2: C71.2 C73.2 J7.1 L4.2
NetL1_1: L1.1 R54.2 U10.16(OUTPA) U10.17(OUTPA)
NetL4_1: L4.1 R58.2 U10.2(OUTPB) U10.3(OUTPB)
NetQ1_5: Q1.5(G2) Q1.6(D1) R44.1
NetQ2_5: Q2.5(G2) Q2.6(D1) R45.1
NetR57_1: R57.1 U10.30(GAIN0)
NetR59_1: R59.1 U10.31(GAIN1)

Not connected (* = marked no-connect by the designer): U10 25(SYNCCLK)* 28(DIAG)*

### Notes on the sheet
- SOM ANALOG AUDIO OUT
- SOM ANALOG AUDIO IN

### Library data of the parts
C11 = CMP-1036-04520-1: as C9 on sheet 2 - Peripherals; Technology: SMT; Tolerance: Â±20%; Max Thickness: 1 mm; Rated Voltage: 6.3 V
C12 C21 C26 C66 = CMP-1036-04946-1: CAP 22uF 16V Â±20% 0805 (2012 Metric) Thickness 1.45mm SMD; Case-Metric: 2012; Case-EIA: 0805; Tolerance: Â±20%; Max Thickness: 1.45 mm; Rated Voltage: 16 V; Technology: SMT
C13 C18-C20 C23 C24 C27 C64 C65 C67 C68 C70 C71 C73 = CMP-1036-04411-1: CAP 100nF 25V Â±10% 0805 (2012 Metric) Thickness 1mm SMD; Case-EIA: 0805; Case-Metric: 2012; Max Thickness: 1 mm; Rated Voltage: 25 V; Technology: SMT; Tolerance: Â±10%
C17 C22 C69 C72 = CMP-1036-04411-1: Case-EIA: 0805; Rated Voltage: 25 V; Case-Metric: 2012; Tolerance: Â±10%; Max Thickness: 1 mm; Technology: SMT
J3-J5 J7 = CON_HRS_DF13-2P-1.25DS(20): CONN HEADER 2POS 1.25MM R/A THT TIN; Manufacturer: Hirose Electric Co Ltd; Connector Type: Header, Shrouded; Number of Positions: 2; Number of Positions Loaded: All; Pitch: 0.049" (1.25mm); Manufacturer Part Number: DF13-2P-1.25DS(20); RoHS: RoHS Compliant; Category: Connectors, Interconnects; Packaging: Tube; Contact Type: Male Pin; Number of Rows: 1; Row Spacing: -; Contact Mating Length: -; Mounting Type: Through Hole, Right Angle; Termination: Solder; Fastening Type: -; Features: Board Guide; Contact Finish: Tin; Contact Finish Thickness: -; Color: Beige; ComponentLink1URL: http://www.hirose.co.jp/cataloge_hp/2d/EDC3-081817-01.pdf; ComponentLink1Description: http://www.hirose.co.jp/cataloge_hp/2d/EDC3-081817-01.pdf
L1-L4 = CMP-1392-00033-1: Power Multilayer Inductor WE-PMI, L=1.00 ÂµH; PartNumber: 74479775210; Manufacturer: Wuerth Elektronik; ComponentLink1URL: http://www.we-online.com; PackageReference: SMD 0805_A; Inductance: 1.00 ÂµH; ComponentLink1Description: Manufacturer URL; ComponentLink2Description: Datasheet; ComponentLink2URL: http://katalog.we-online.de/kataloge/eisos/media/pdf/74479775210A.pdf
Q1 Q2 = CMP-1058-00639-1: Small Signal MOSFET, 30 V / -20 V, +0.25 / -0.88 A, Complementary, 6-Pin SC70, Pb-Free, Tape and Reel; Manufacturer: On Semiconductor; VGS(th) Max (V): 1.5; PD Max (W): 0.27; Configuration: Dual; ComponentLink1URL: http://www.onsemi.com/; DatasheetVersion: Rev. 2; RoHS: Pb-Free; Mounting Technology: Surface Mount; PartNumber: NTJD4158CT2G; ComponentLink3Description: Package Specification; ComponentLink2URL: http://www.onsemi.com/pub_link/Collateral/NTJD4158C-D.PDF; ComponentLink1Description: Manufacturer URL; Packing: Tape and Reel; ComponentLink2Description: Datasheet; PackageDescription: 6-Pin Small Outline Transistor, Body 2 x 1.25 mm, Pitch 0.65 mm; ComponentLink3URL: http://www.onsemi.com/pub_link/Collateral/SMF05C-D.PDF; Channel Polarity: Complementary; PackageReference: SC70-6-419B-02_W; Package Type: SC-88-6 / SC-70-6 / SOT-363-6; PackageVersion: Rev. W; PartId: 1
R39-R41 R44 R45 R49 R53 R57 R59 R98 = CMP-1013-00623-1: as R16 on sheet 1 - SOM; Tolerance: 1 %; Power: 0.125 W; Technology: SMT
R54 R58 = CMP-1013-00341-1: as R3 on sheet 2 - Peripherals; Technology: SMT; Power: 0.125 W; Tolerance: 1 %
R99 = CMP-1013-00341-1: Power: 0.125 W; Case-EIA: 0805; Tolerance: 1 %; Case-Metric: 2012; Technology: SMT
U10 = TDA7491LP: 2x5W DUAL BTL CLASS-D AUDIO AMPLIFIER